# EAGLE schematic 016-5_spdif-simple_main_revb_sch-pcb (EAGLE 7.7.0)

## Sheet 1 of 5: SPDIF
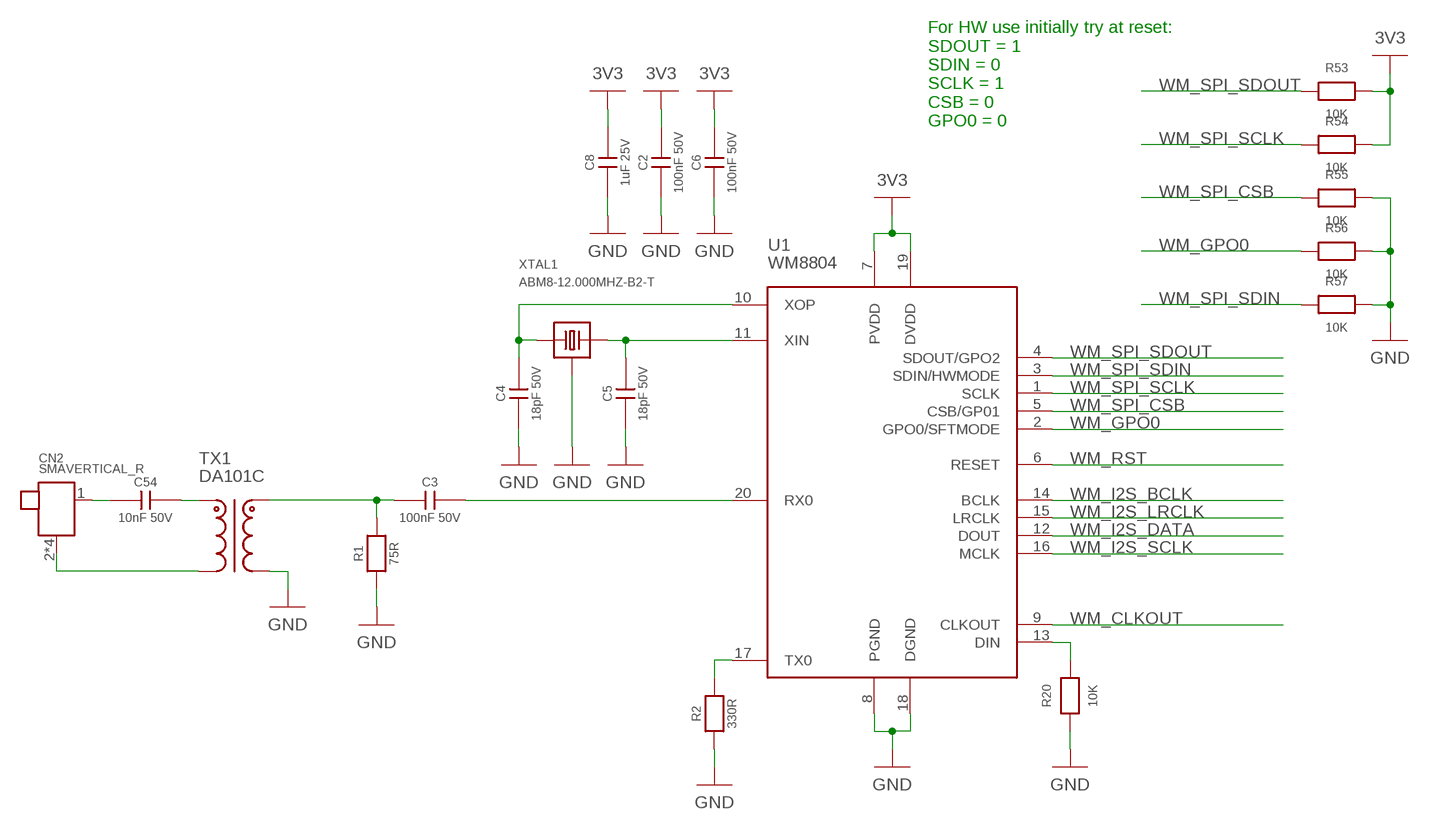
[diagram p0: schematic, sheet 1]

### Parts
C2  100nF 50V  VJ0603Y104KXACW1BC  [0603]
C3  100nF 50V  VJ0603Y104KXACW1BC  [0603]
C4  18pF 50V  MC0603N180J500CT  [0603]
C5  18pF 50V  MC0603N180J500CT  [0603]
C6  100nF 50V  VJ0603Y104KXACW1BC  [0603]
C8  1uF 25V  MC0603X105K250CT  [0603]
C54  10nF 50V  MC0603B103K500CT  [0603]
CN2  SMAVERTICAL_R  [SMAVERTICAL]
R1  75R  CRCW060375R0FKEA  [0603]
R2  330R  CRCW0603330RFKEA  [0603]
R20  10K  CRCW060310K0FKEA  [0603]
R53  10K  CRCW060310K0FKEA  [0603]
R54  10K  CRCW060310K0FKEA  [0603]
R55  10K  CRCW060310K0FKEA  [0603]
R56  10K  CRCW060310K0FKEA  [0603]
R57  10K  CRCW060310K0FKEA  [0603]
TX1  DA101C  [DA10XC]
U1  WM8804  WM8804GEDS/RV  [SSOP20-5MM]
XTAL1  ABM8-12.000MHZ-B2-T  [3.2X3.5SMD]

### Nets
3V3: C2.2 C6.2 C8.2 R53.2 R54.2 U1.7(PVDD) U1.19(DVDD) ; also sheet 2,4
GND: C2.1 C4.1 C5.1 C6.1 C8.1 R1.1 R2.1 R20.1 R55.2 R56.2 R57.2 TX1.4(B2) U1.8(PGND) U1.18(DGND) XTAL1.2(GND) XTAL1.4(GND) ; also sheet 2,3,4
N$4: C3.2 U1.20(RX0)
N$5: R2.2 U1.17(TX0)
N$11: C4.2 U1.10(XOP) XTAL1.3
N$12: C5.2 U1.11(XIN) XTAL1.1
N$13: R20.2 U1.13(DIN)
N$40: C54.2 TX1.1(A1)
N$46: CN2.2 CN2.3 CN2.4 CN2.5 TX1.3(A2)
N$55: C54.1 CN2.1
SPDIF_IN: C3.1 R1.2 TX1.6(B1)
WM_CLKOUT: U1.9(CLKOUT) ; also sheet 2
WM_GPO0: R56.1 U1.2(GPO0/SFTMODE) ; also sheet 2
WM_I2S_BCLK: U1.14(BCLK) ; also sheet 2
WM_I2S_DATA: U1.12(DOUT) ; also sheet 2
WM_I2S_LRCLK: U1.15(LRCLK) ; also sheet 2
WM_I2S_SCLK: U1.16(MCLK) ; also sheet 2
WM_RST: U1.6(RESET) ; also sheet 2
WM_SPI_CSB: R55.1 U1.5(CSB/GP01) ; also sheet 2
WM_SPI_SCLK: R54.1 U1.1(SCLK) ; also sheet 2
WM_SPI_SDIN: R57.1 U1.3(SDIN/HWMODE) ; also sheet 2
WM_SPI_SDOUT: R53.1 U1.4(SDOUT/GPO2) ; also sheet 2

### Notes on the sheet
- For HW use initially try at reset:
  SDOUT = 1
  SDIN = 0
  SCLK = 1
  CSB = 0
  GPO0 = 0

## Sheet 2 of 5: FPGA
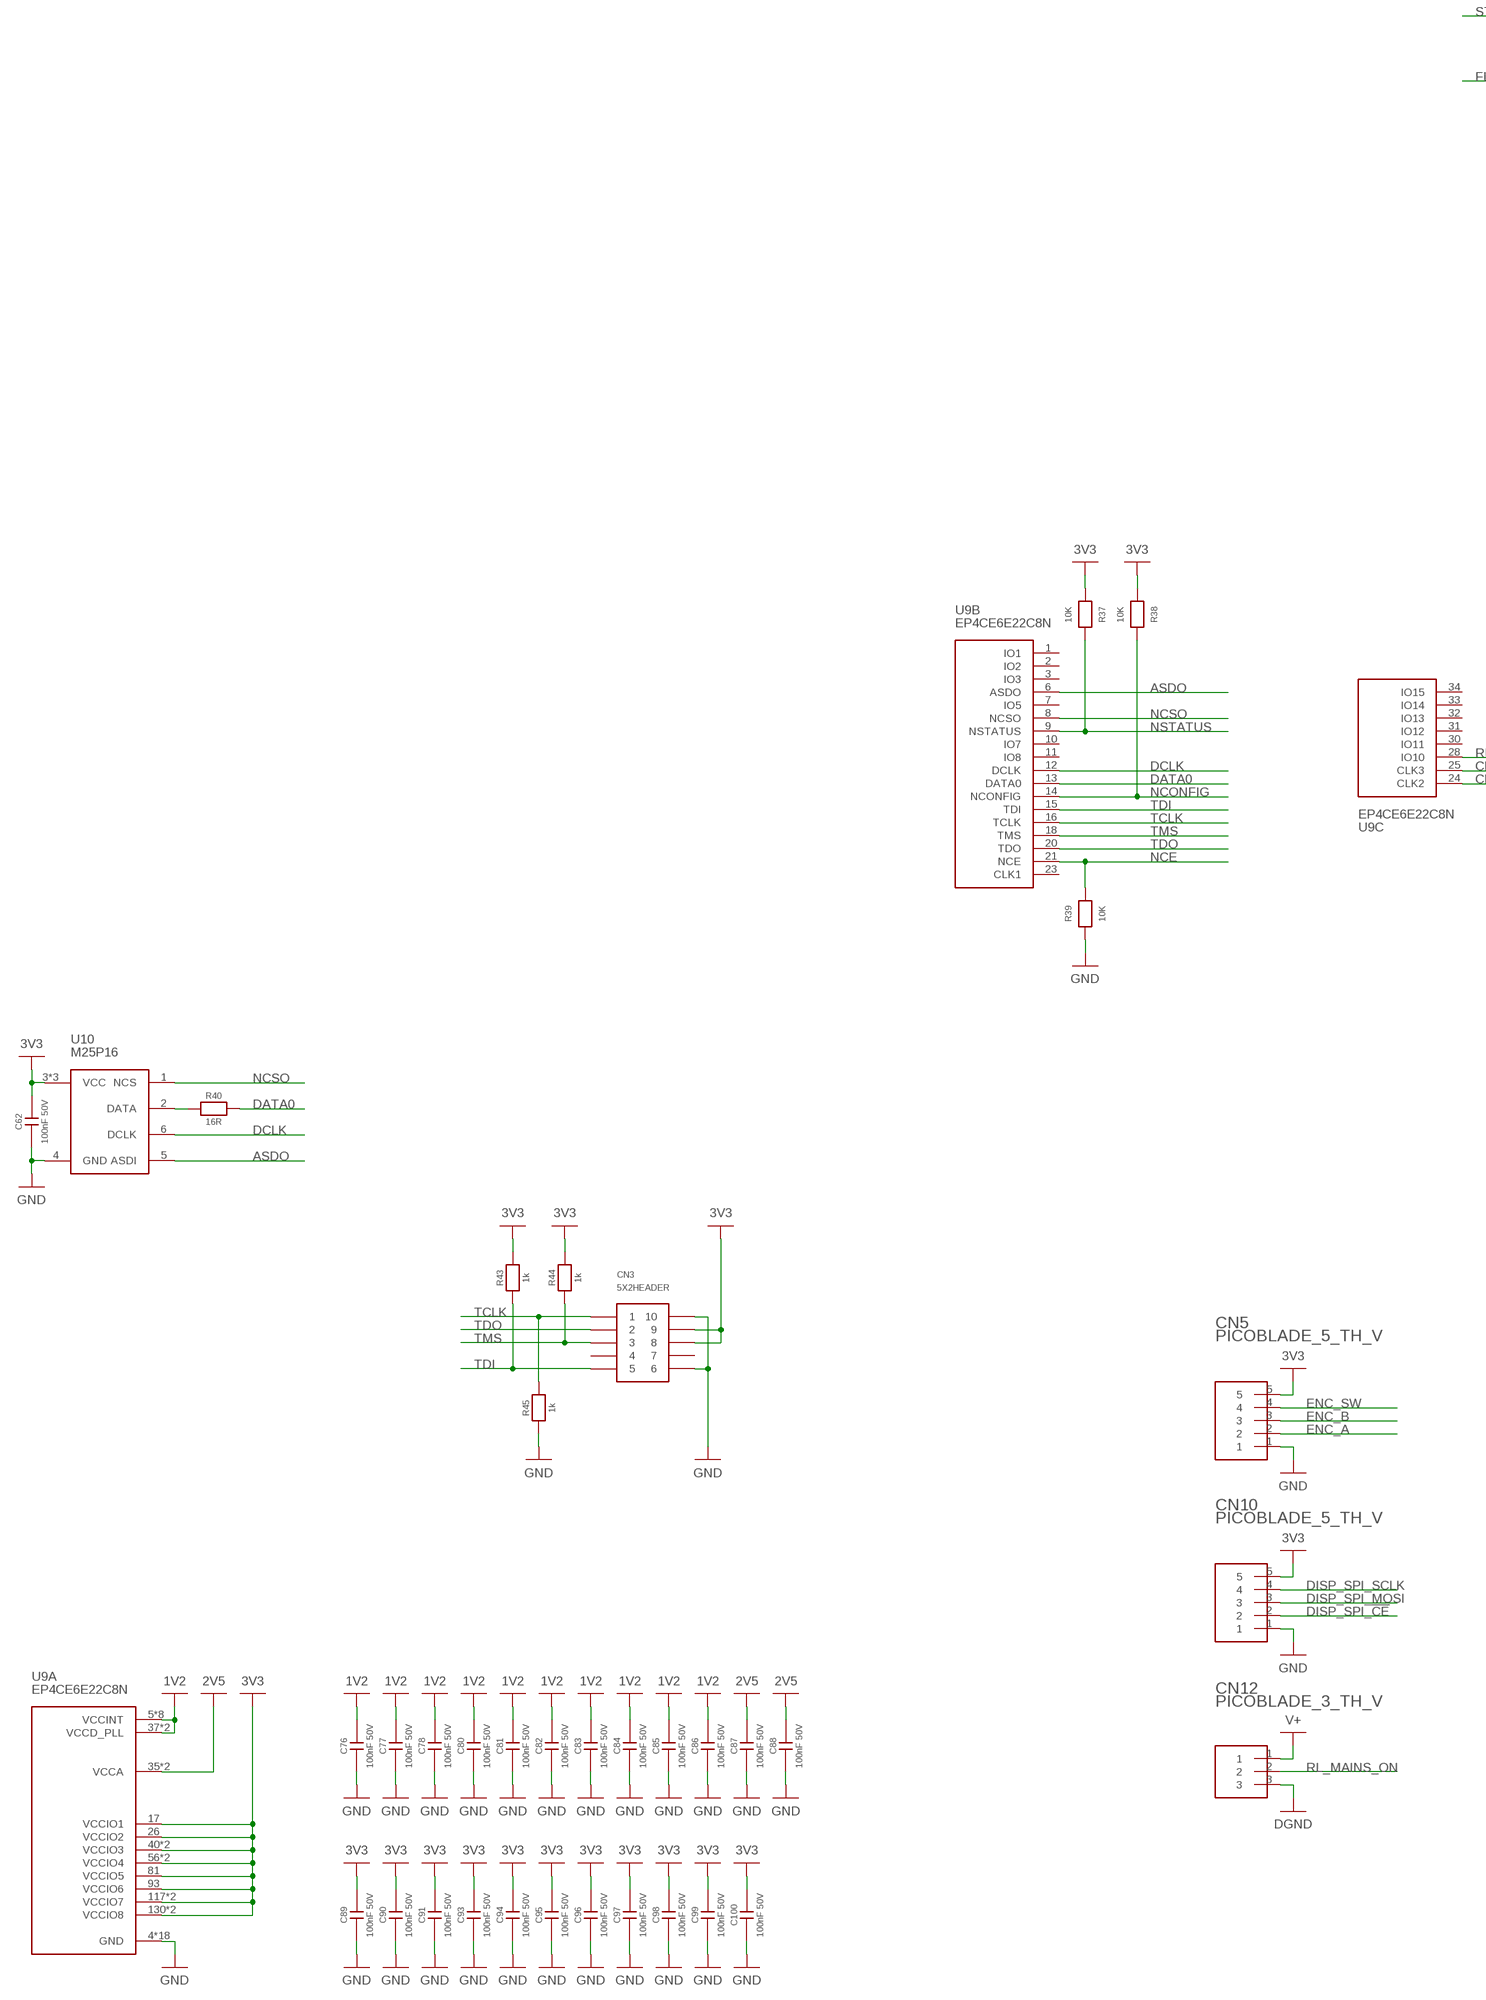
[diagram p1: schematic, sheet 2, part 1 of 2]
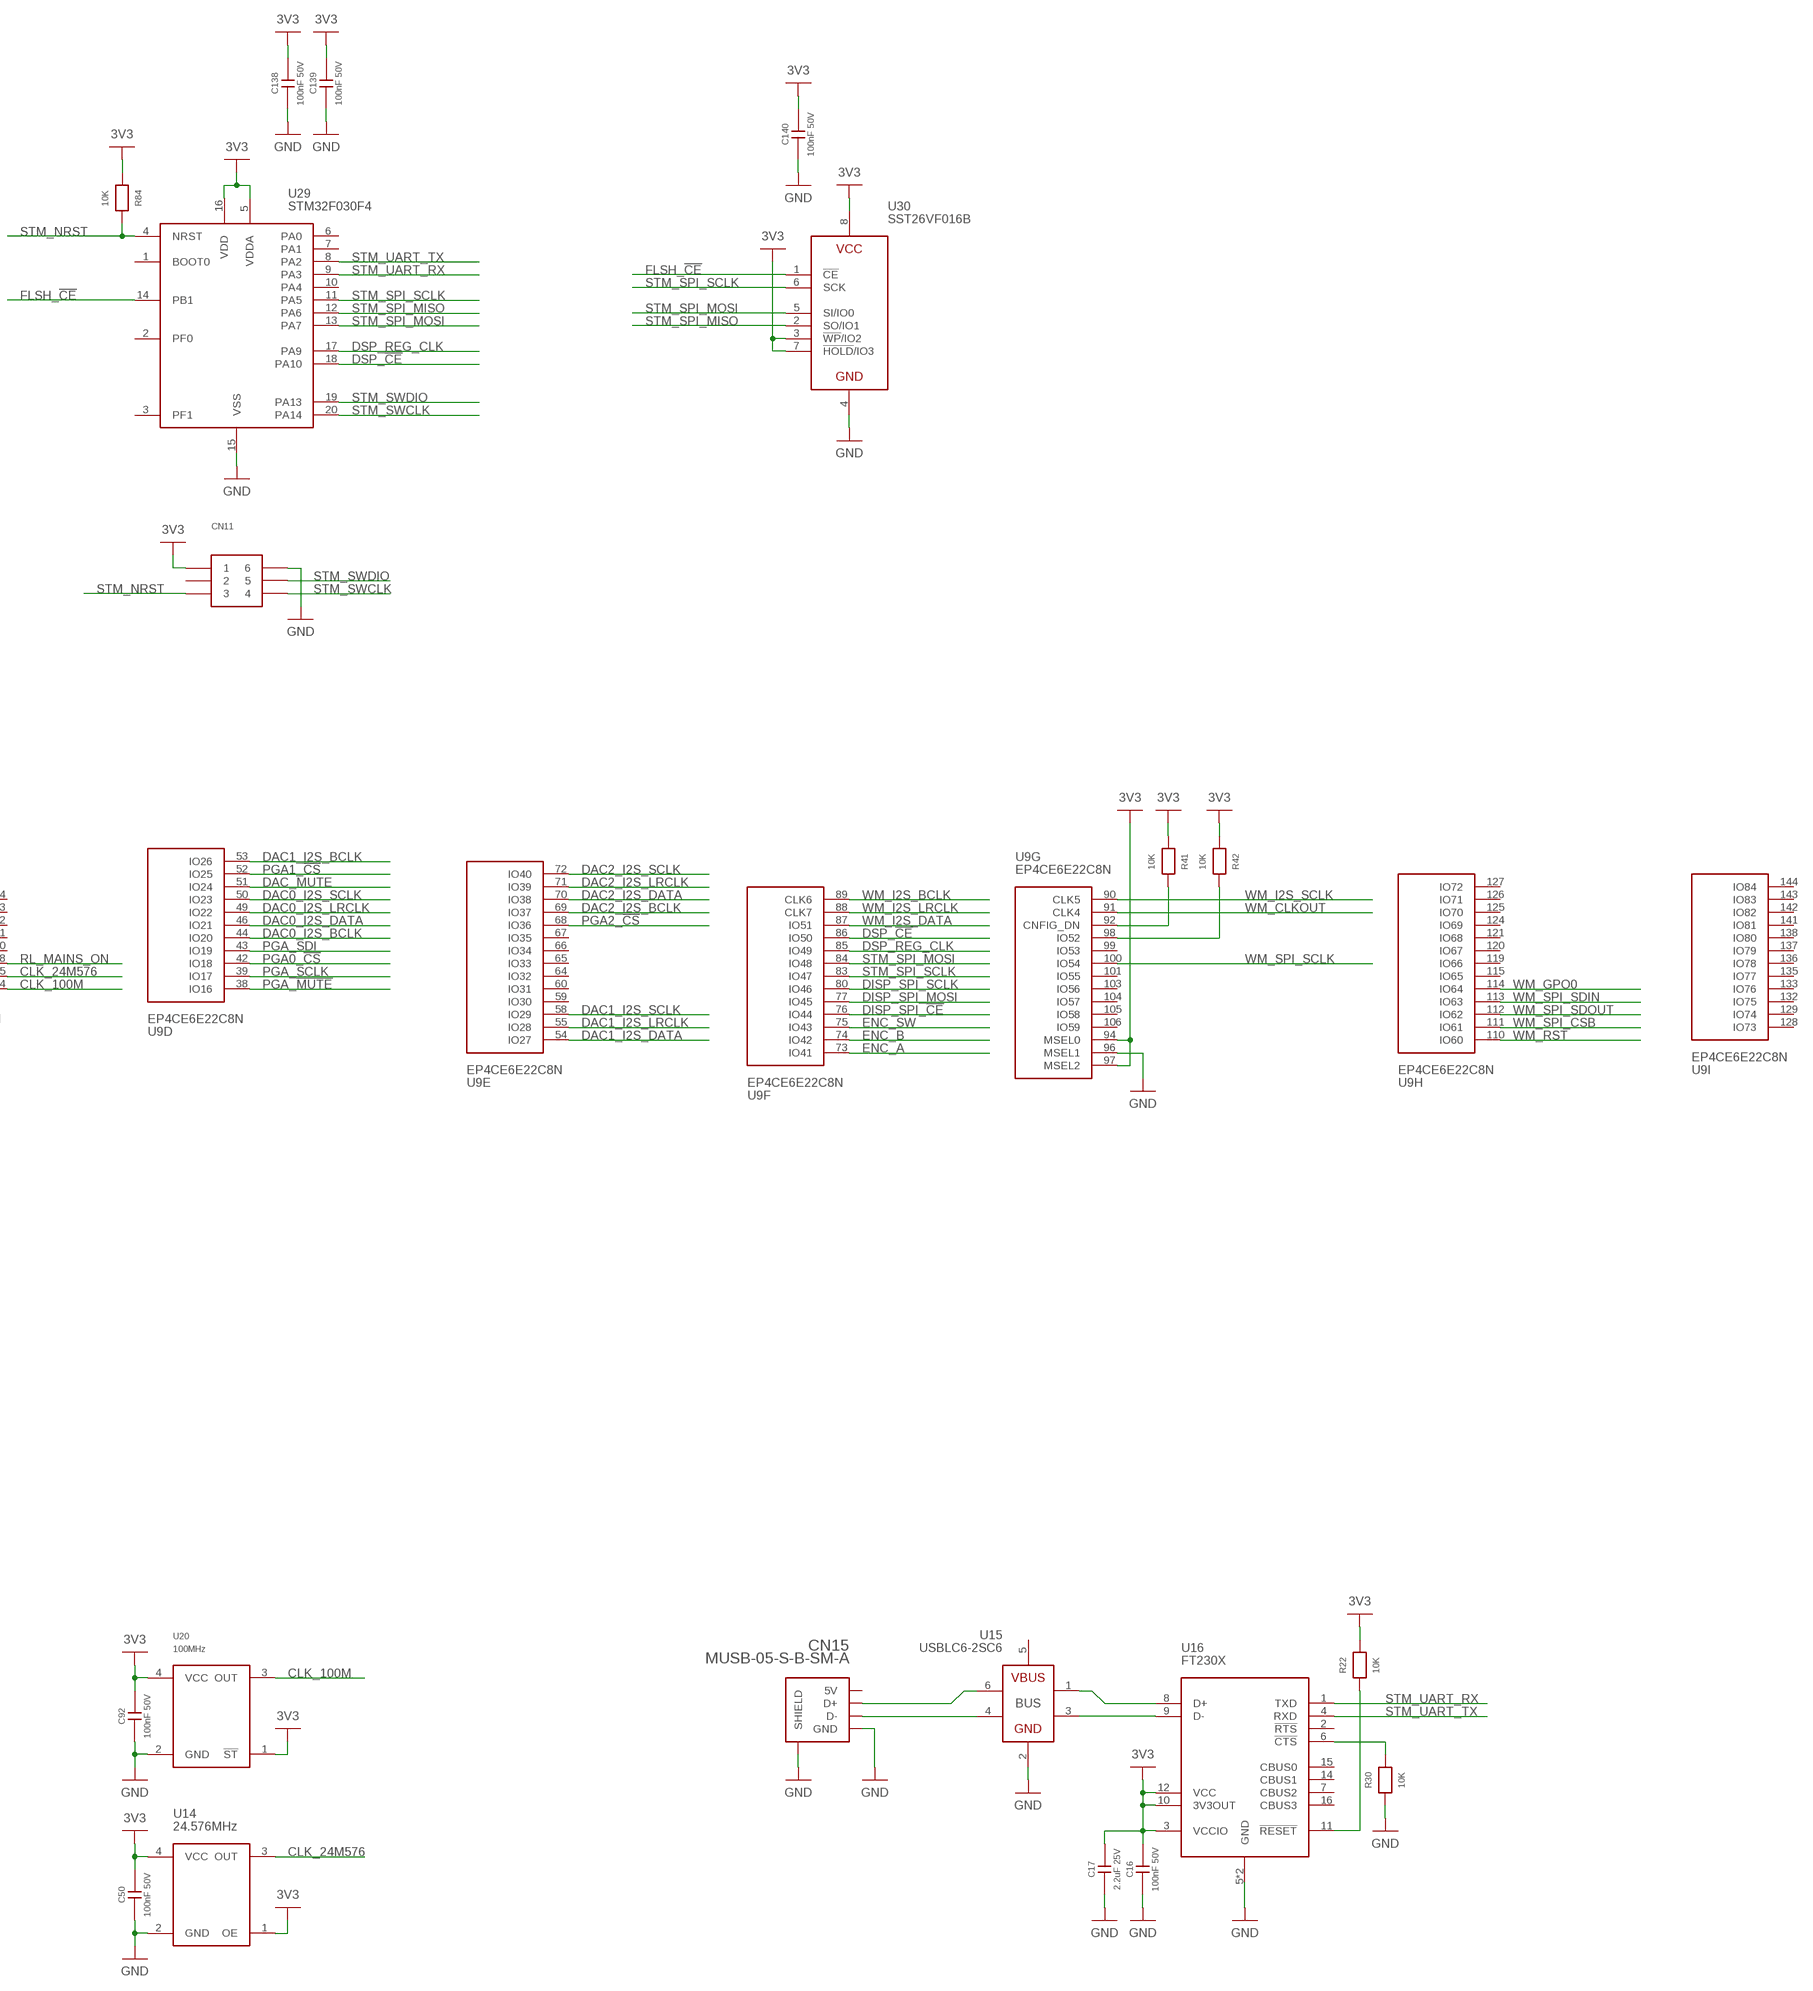
[diagram p2: schematic, sheet 2, part 2 of 2]

### Parts
C16  100nF 50V  VJ0603Y104KXACW1BC  [0603]
C17  2.2uF 25V  GRM188R61E225KA12D  [0603]
C50  100nF 50V  VJ0603Y104KXACW1BC  [0603]
C62  100nF 50V  VJ0603Y104KXACW1BC  [0603]
C76  100nF 50V  VJ0603Y104KXACW1BC  [0603]
C77  100nF 50V  VJ0603Y104KXACW1BC  [0603]
C78  100nF 50V  VJ0603Y104KXACW1BC  [0603]
C80  100nF 50V  VJ0603Y104KXACW1BC  [0603]
C81  100nF 50V  VJ0603Y104KXACW1BC  [0603]
C82  100nF 50V  VJ0603Y104KXACW1BC  [0603]
C83  100nF 50V  VJ0603Y104KXACW1BC  [0603]
C84  100nF 50V  VJ0603Y104KXACW1BC  [0603]
C85  100nF 50V  VJ0603Y104KXACW1BC  [0603]
C86  100nF 50V  VJ0603Y104KXACW1BC  [0603]
C87  100nF 50V  VJ0603Y104KXACW1BC  [0603]
C88  100nF 50V  VJ0603Y104KXACW1BC  [0603]
C89  100nF 50V  VJ0603Y104KXACW1BC  [0603]
C90  100nF 50V  VJ0603Y104KXACW1BC  [0603]
C91  100nF 50V  VJ0603Y104KXACW1BC  [0603]
C92  100nF 50V  VJ0603Y104KXACW1BC  [0603]
C93  100nF 50V  VJ0603Y104KXACW1BC  [0603]
C94  100nF 50V  VJ0603Y104KXACW1BC  [0603]
C95  100nF 50V  VJ0603Y104KXACW1BC  [0603]
C96  100nF 50V  VJ0603Y104KXACW1BC  [0603]
C97  100nF 50V  VJ0603Y104KXACW1BC  [0603]
C98  100nF 50V  VJ0603Y104KXACW1BC  [0603]
C99  100nF 50V  VJ0603Y104KXACW1BC  [0603]
C100  100nF 50V  VJ0603Y104KXACW1BC  [0603]
C138  100nF 50V  VJ0603Y104KXACW1BC  [0603]
C139  100nF 50V  VJ0603Y104KXACW1BC  [0603]
C140  100nF 50V  VJ0603Y104KXACW1BC  [0603]
CN3  5X2HEADER  [5X2_2.54MMHEADER]
CN5  PICOBLADE_5_TH_V  [MOLEX_530470510]
CN10  PICOBLADE_5_TH_V  [MOLEX_530470510]
CN11  2X3_HEADER  [2X3HEADER]
CN12  PICOBLADE_3_TH_V  [MOLEX_530470310]
CN15  MUSB-05-S-B-SM-A  [MUSB-05-S-B-SM-A]
R22  10K  CRCW060310K0FKEA  [0603]
R30  10K  CRCW060310K0FKEA  [0603]
R37  10K  CRCW060310K0FKEA  [0603]
R38  10K  CRCW060310K0FKEA  [0603]
R39  10K  CRCW060310K0FKEA  [0603]
R40  16R  CRCW060316R0FKEA  [0603]
R41  10K  CRCW060310K0FKEA  [0603]
R42  10K  CRCW060310K0FKEA  [0603]
R43  1k  CRCW06031K00FKEA  [0603]
R44  1k  CRCW06031K00FKEA  [0603]
R45  1k  CRCW06031K00FKEA  [0603]
R84  10K  CRCW060310K0FKEA  [0603]
U9  EP4CE6E22C8N  [QFP144_PP]
U10  M25P16  M25P16-VMN6P  [SO8]
U14  24.576MHz  ASEMB-24.576MHZ  [ASEMB]
U15  USBLC6-2SC6  [SOT23-6]
U16  FT230X  FT230XS  [SSOP16-4MM]
U20  100MHz  510BBA100M000BAG  [5X3.2SEAM]
U29  STM32F030F4  [SSOP20-4.5MM]
U30  SST26VF016B  SST26VF016B-104I/SN  [SO8]

### Nets
1V2: C76.2 C77.2 C78.2 C80.2 C81.2 C82.2 C83.2 C84.2 C85.2 C86.2 U9.5(A:VCCINT) U9.29(A:VCCINT) U9.37(A:VCCD_PLL) U9.45(A:VCCINT) U9.61(A:VCCINT) U9.78(A:VCCINT) U9.102(A:VCCINT) U9.109(A:VCCD_PLL) U9.116(A:VCCINT) U9.134(A:VCCINT) ; also sheet 4
2V5: C87.2 C88.2 U9.35(A:VCCA) U9.107(A:VCCA) ; also sheet 4
3V3: C16.2 C17.2 C50.2 C62.2 C89.2 C90.2 C91.2 C92.2 C93.2 C94.2 C95.2 C96.2 C97.2 C98.2 C99.2 C100.2 C138.2 C139.2 C140.2 CN3.8 CN3.9 CN5.5 CN10.5 CN11.1 R22.2 R37.1 R38.1 R41.1 R42.1 R43.2 R44.2 R84.1 U9.17(A:VCCIO1) U9.26(A:VCCIO2) U9.40(A:VCCIO3) U9.47(A:VCCIO3) U9.56(A:VCCIO4) U9.62(A:VCCIO4) U9.81(A:VCCIO5) U9.93(A:VCCIO6) U9.94(G:MSEL0) U9.97(G:MSEL2) U9.117(A:VCCIO7) U9.122(A:VCCIO7) U9.130(A:VCCIO8) U9.139(A:VCCIO8) U10.3(VCC) U10.7(VCC) U10.8(VCC) U14.1(OE) U14.4(VCC) U16.3(VCCIO) U16.10(3V3OUT) U16.12(VCC) U20.1(!ST) U20.4(VCC) U29.5(VDDA) U29.16(VDD) U30.3(!WP!/IO2) U30.7(!HOLD!/IO3) U30.8(VCC) ; also sheet 1,4
ASDO: U9.6(B:ASDO) U10.5(ASDI)
CLK_24M576: U9.25(C:CLK3) U14.3(OUT)
CLK_100M: U9.24(C:CLK2) U20.3(OUT)
CONF_DN: R41.2 U9.92(G:CNFIG_DN)
DAC0_I2S_BCLK: U9.44(D:IO20) ; also sheet 3
DAC0_I2S_DATA: U9.46(D:IO21) ; also sheet 3
DAC0_I2S_LRCLK: U9.49(D:IO22) ; also sheet 3
DAC0_I2S_SCLK: U9.50(D:IO23) ; also sheet 3
DAC1_I2S_BCLK: U9.53(D:IO26) ; also sheet 3
DAC1_I2S_DATA: U9.54(E:IO27) ; also sheet 3
DAC1_I2S_LRCLK: U9.55(E:IO28) ; also sheet 3
DAC1_I2S_SCLK: U9.58(E:IO29) ; also sheet 3
DAC2_I2S_BCLK: U9.69(E:IO37) ; also sheet 3
DAC2_I2S_DATA: U9.70(E:IO38) ; also sheet 3
DAC2_I2S_LRCLK: U9.71(E:IO39) ; also sheet 3
DAC2_I2S_SCLK: U9.72(E:IO40) ; also sheet 3
DAC_MUTE: U9.51(D:IO24) ; also sheet 3
DATA0: R40.2 U9.13(B:DATA0)
DCLK: U9.12(B:DCLK) U10.6(DCLK)
DGND: CN12.3
DISP_SPI_!CE: CN10.2 U9.76(F:IO44)
DISP_SPI_MOSI: CN10.3 U9.77(F:IO45)
DISP_SPI_SCLK: CN10.4 U9.80(F:IO46)
DSP_!CE: U9.86(F:IO50) U29.18(PA10)
DSP_REG_CLK: U9.85(F:IO49) U29.17(PA9)
ENC_A: CN5.2 U9.73(F:IO41)
ENC_B: CN5.3 U9.74(F:IO42)
ENC_SW: CN5.4 U9.75(F:IO43)
FLSH_!CE: U29.14(PB1) U30.1(!CE)
GND: C16.1 C17.1 C50.1 C62.1 C76.1 C77.1 C78.1 C80.1 C81.1 C82.1 C83.1 C84.1 C85.1 C86.1 C87.1 C88.1 C89.1 C90.1 C91.1 C92.1 C93.1 C94.1 C95.1 C96.1 C97.1 C98.1 C99.1 C100.1 C138.1 C139.1 C140.1 CN3.6 CN3.10 CN5.1 CN10.1 CN11.6 CN15.GND CN15.SHIELD1(SHIELD) CN15.SHIELD2(SHIELD) CN15.SHIELD3(SHIELD) CN15.SHIELD4(SHIELD) R30.1 R39.1 R45.1 U9.4(A:GND) U9.19(A:GND) U9.22(A:GND) U9.27(A:GND) U9.36(A:GND) U9.41(A:GND) U9.48(A:GND) U9.57(A:GND) U9.63(A:GND) U9.79(A:GND) U9.82(A:GND) U9.95(A:GND) U9.96(G:MSEL1) U9.108(A:GND) U9.118(A:GND) U9.123(A:GND) U9.131(A:GND) U9.140(A:GND) U9.GND(A:GND) U10.4(GND) U14.2(GND) U15.2(GND) U16.5(GND) U16.13(GND) U20.2(GND) U29.15(VSS) U30.4(GND) ; also sheet 1,3,4
INIT_DONE: R42.2 U9.98(G:IO52)
N$17: R40.1 U10.2(DATA)
N$27: CN15.D- U15.4(D-OUT)
N$28: CN15.D+ U15.6(D+_OUT)
N$29: U15.3(D-_IN) U16.9(D-)
N$53: U15.1(D+_IN) U16.8(D+)
N$54: R22.1 U16.11(!RESET)
N$56: R30.2 U16.6(!CTS)
NCE: R39.2 U9.21(B:NCE)
NCONFIG: R38.2 U9.14(B:NCONFIG)
NCSO: U9.8(B:NCSO) U10.1(NCS)
NSTATUS: R37.2 U9.9(B:NSTATUS)
PGA0_!CS: U9.42(D:IO18) ; also sheet 3
PGA1_!CS: U9.52(D:IO25) ; also sheet 3
PGA2_!CS: U9.68(E:IO36) ; also sheet 3
PGA_!MUTE: U9.38(D:IO16) ; also sheet 3
PGA_SCLK: U9.39(D:IO17) ; also sheet 3
PGA_SDI: U9.43(D:IO19) ; also sheet 3
RL_MAINS_ON: CN12.2 U9.28(C:IO10)
STM_NRST: CN11.3 R84.2 U29.4(NRST)
STM_SPI_MISO: U29.12(PA6) U30.2(SO/IO1)
STM_SPI_MOSI: U9.84(F:IO48) U29.13(PA7) U30.5(SI/IO0)
STM_SPI_SCLK: U9.83(F:IO47) U29.11(PA5) U30.6(SCK)
STM_SWCLK: CN11.4 U29.20(PA14)
STM_SWDIO: CN11.5 U29.19(PA13)
STM_UART_RX: U16.1(TXD) U29.9(PA3)
STM_UART_TX: U16.4(RXD) U29.8(PA2)
TCLK: CN3.1 R45.2 U9.16(B:TCLK)
TDI: CN3.5 R43.1 U9.15(B:TDI)
TDO: CN3.2 U9.20(B:TDO)
TMS: CN3.3 R44.1 U9.18(B:TMS)
V+: CN12.1 ; also sheet 4
WM_CLKOUT: U9.91(G:CLK4) ; also sheet 1
WM_GPO0: U9.114(H:IO64) ; also sheet 1
WM_I2S_BCLK: U9.89(F:CLK6) ; also sheet 1
WM_I2S_DATA: U9.87(F:IO51) ; also sheet 1
WM_I2S_LRCLK: U9.88(F:CLK7) ; also sheet 1
WM_I2S_SCLK: U9.90(G:CLK5) ; also sheet 1
WM_RST: U9.110(H:IO60) ; also sheet 1
WM_SPI_CSB: U9.111(H:IO61) ; also sheet 1
WM_SPI_SCLK: U9.100(G:IO54) ; also sheet 1
WM_SPI_SDIN: U9.113(H:IO63) ; also sheet 1
WM_SPI_SDOUT: U9.112(H:IO62) ; also sheet 1
Unconnected: CN3.4 CN3.7 CN11.2 CN15.VCC(5V) U9.1(B:IO1) U9.2(B:IO2) U9.3(B:IO3) U9.7(B:IO5) U9.10(B:IO7) U9.11(B:IO8) U9.23(B:CLK1) U9.30(C:IO11) U9.31(C:IO12) U9.32(C:IO13) U9.33(C:IO14) U9.34(C:IO15) U9.59(E:IO30) U9.60(E:IO31) U9.64(E:IO32) U9.65(E:IO33) U9.66(E:IO34) U9.67(E:IO35) U9.99(G:IO53) U9.101(G:IO55) U9.103(G:IO56) U9.104(G:IO57) U9.105(G:IO58) U9.106(G:IO59) U9.115(H:IO65) U9.119(H:IO66) U9.120(H:IO67) U9.121(H:IO68) U9.124(H:IO69) U9.125(H:IO70) U9.126(H:IO71) U9.127(H:IO72) U9.128(I:IO73) U9.129(I:IO74) U9.132(I:IO75) U9.133(I:IO76) U9.135(I:IO77) U9.136(I:IO78) U9.137(I:IO79) U9.138(I:IO80) U9.141(I:IO81) U9.142(I:IO82) U9.143(I:IO83) U9.144(I:IO84) U15.5(VBUS) U16.2(!RTS) U16.7(CBUS2) U16.14(CBUS1) U16.15(CBUS0) U16.16(CBUS3) U29.1(BOOT0) U29.2(PF0) U29.3(PF1) U29.6(PA0) U29.7(PA1) U29.10(PA4)

## Sheet 3 of 5: DAC
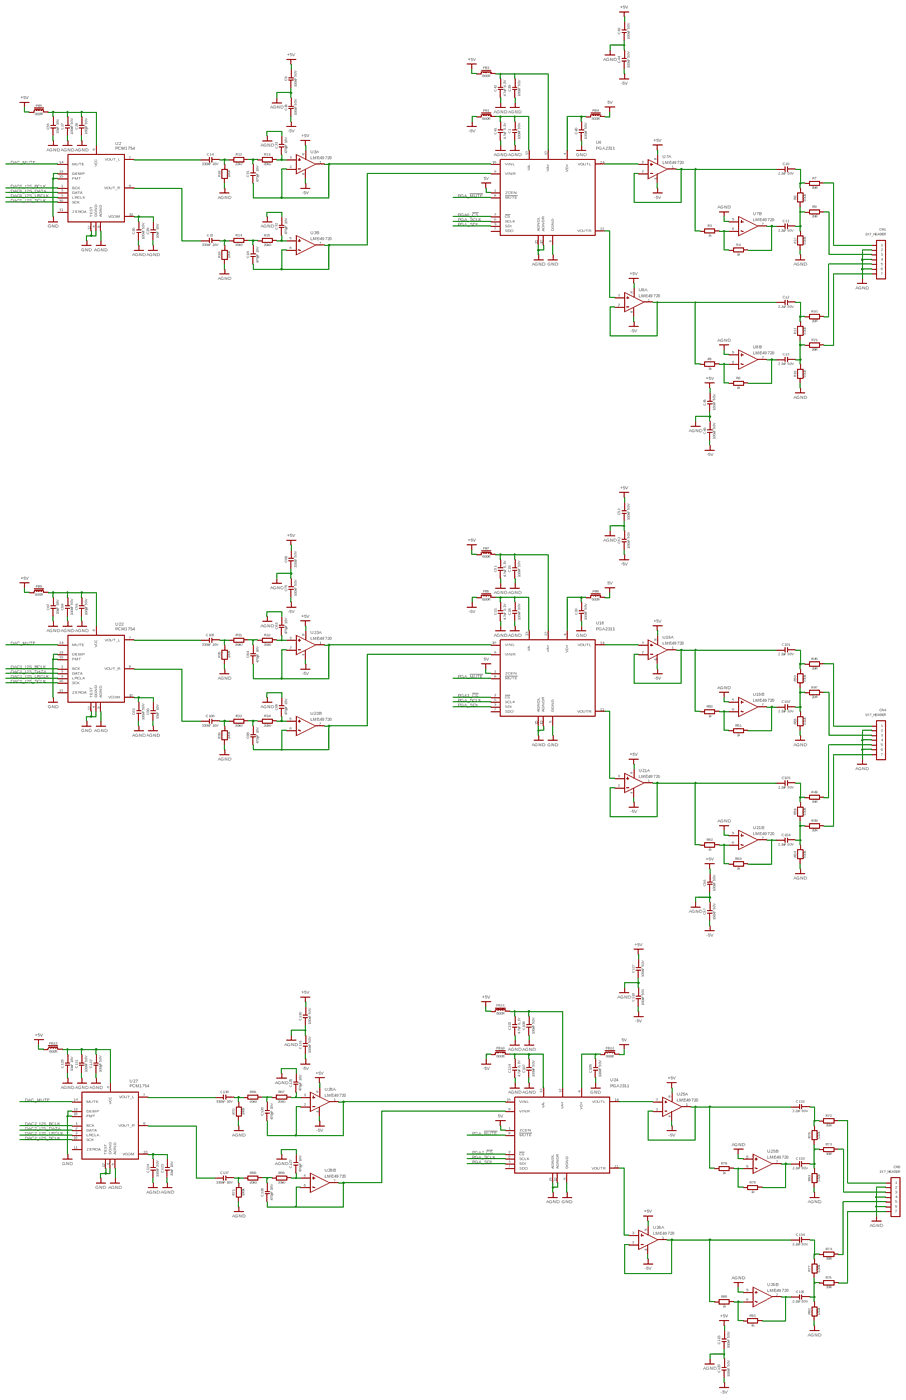
[diagram p3: schematic, sheet 3, overview]
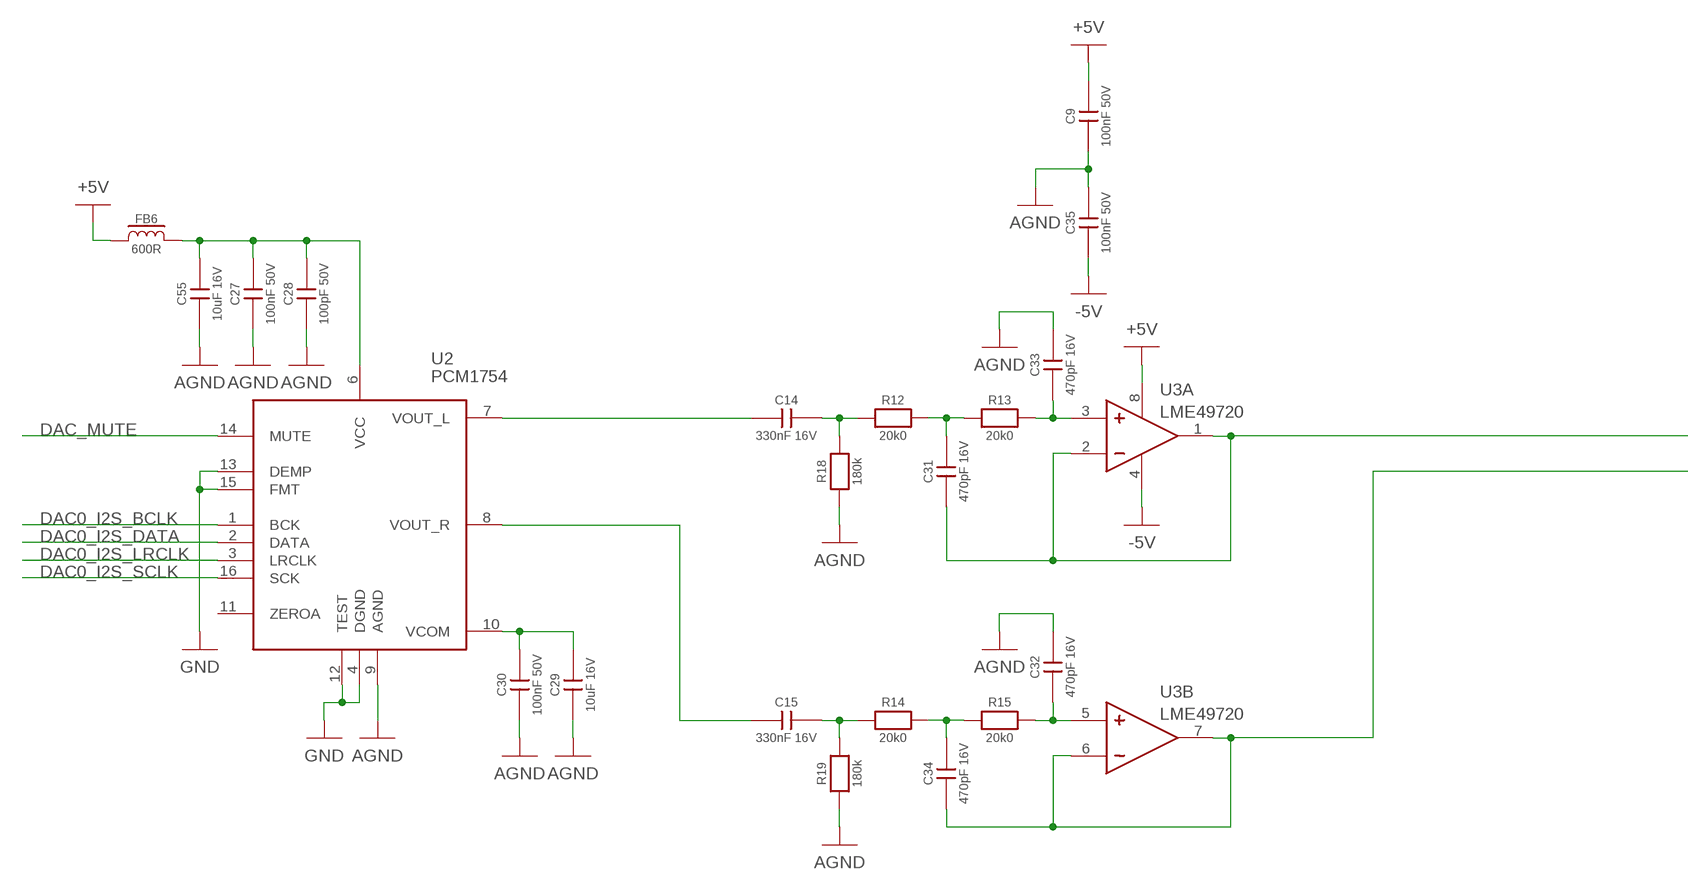
[diagram p4: schematic, sheet 3, part 1 of 4]
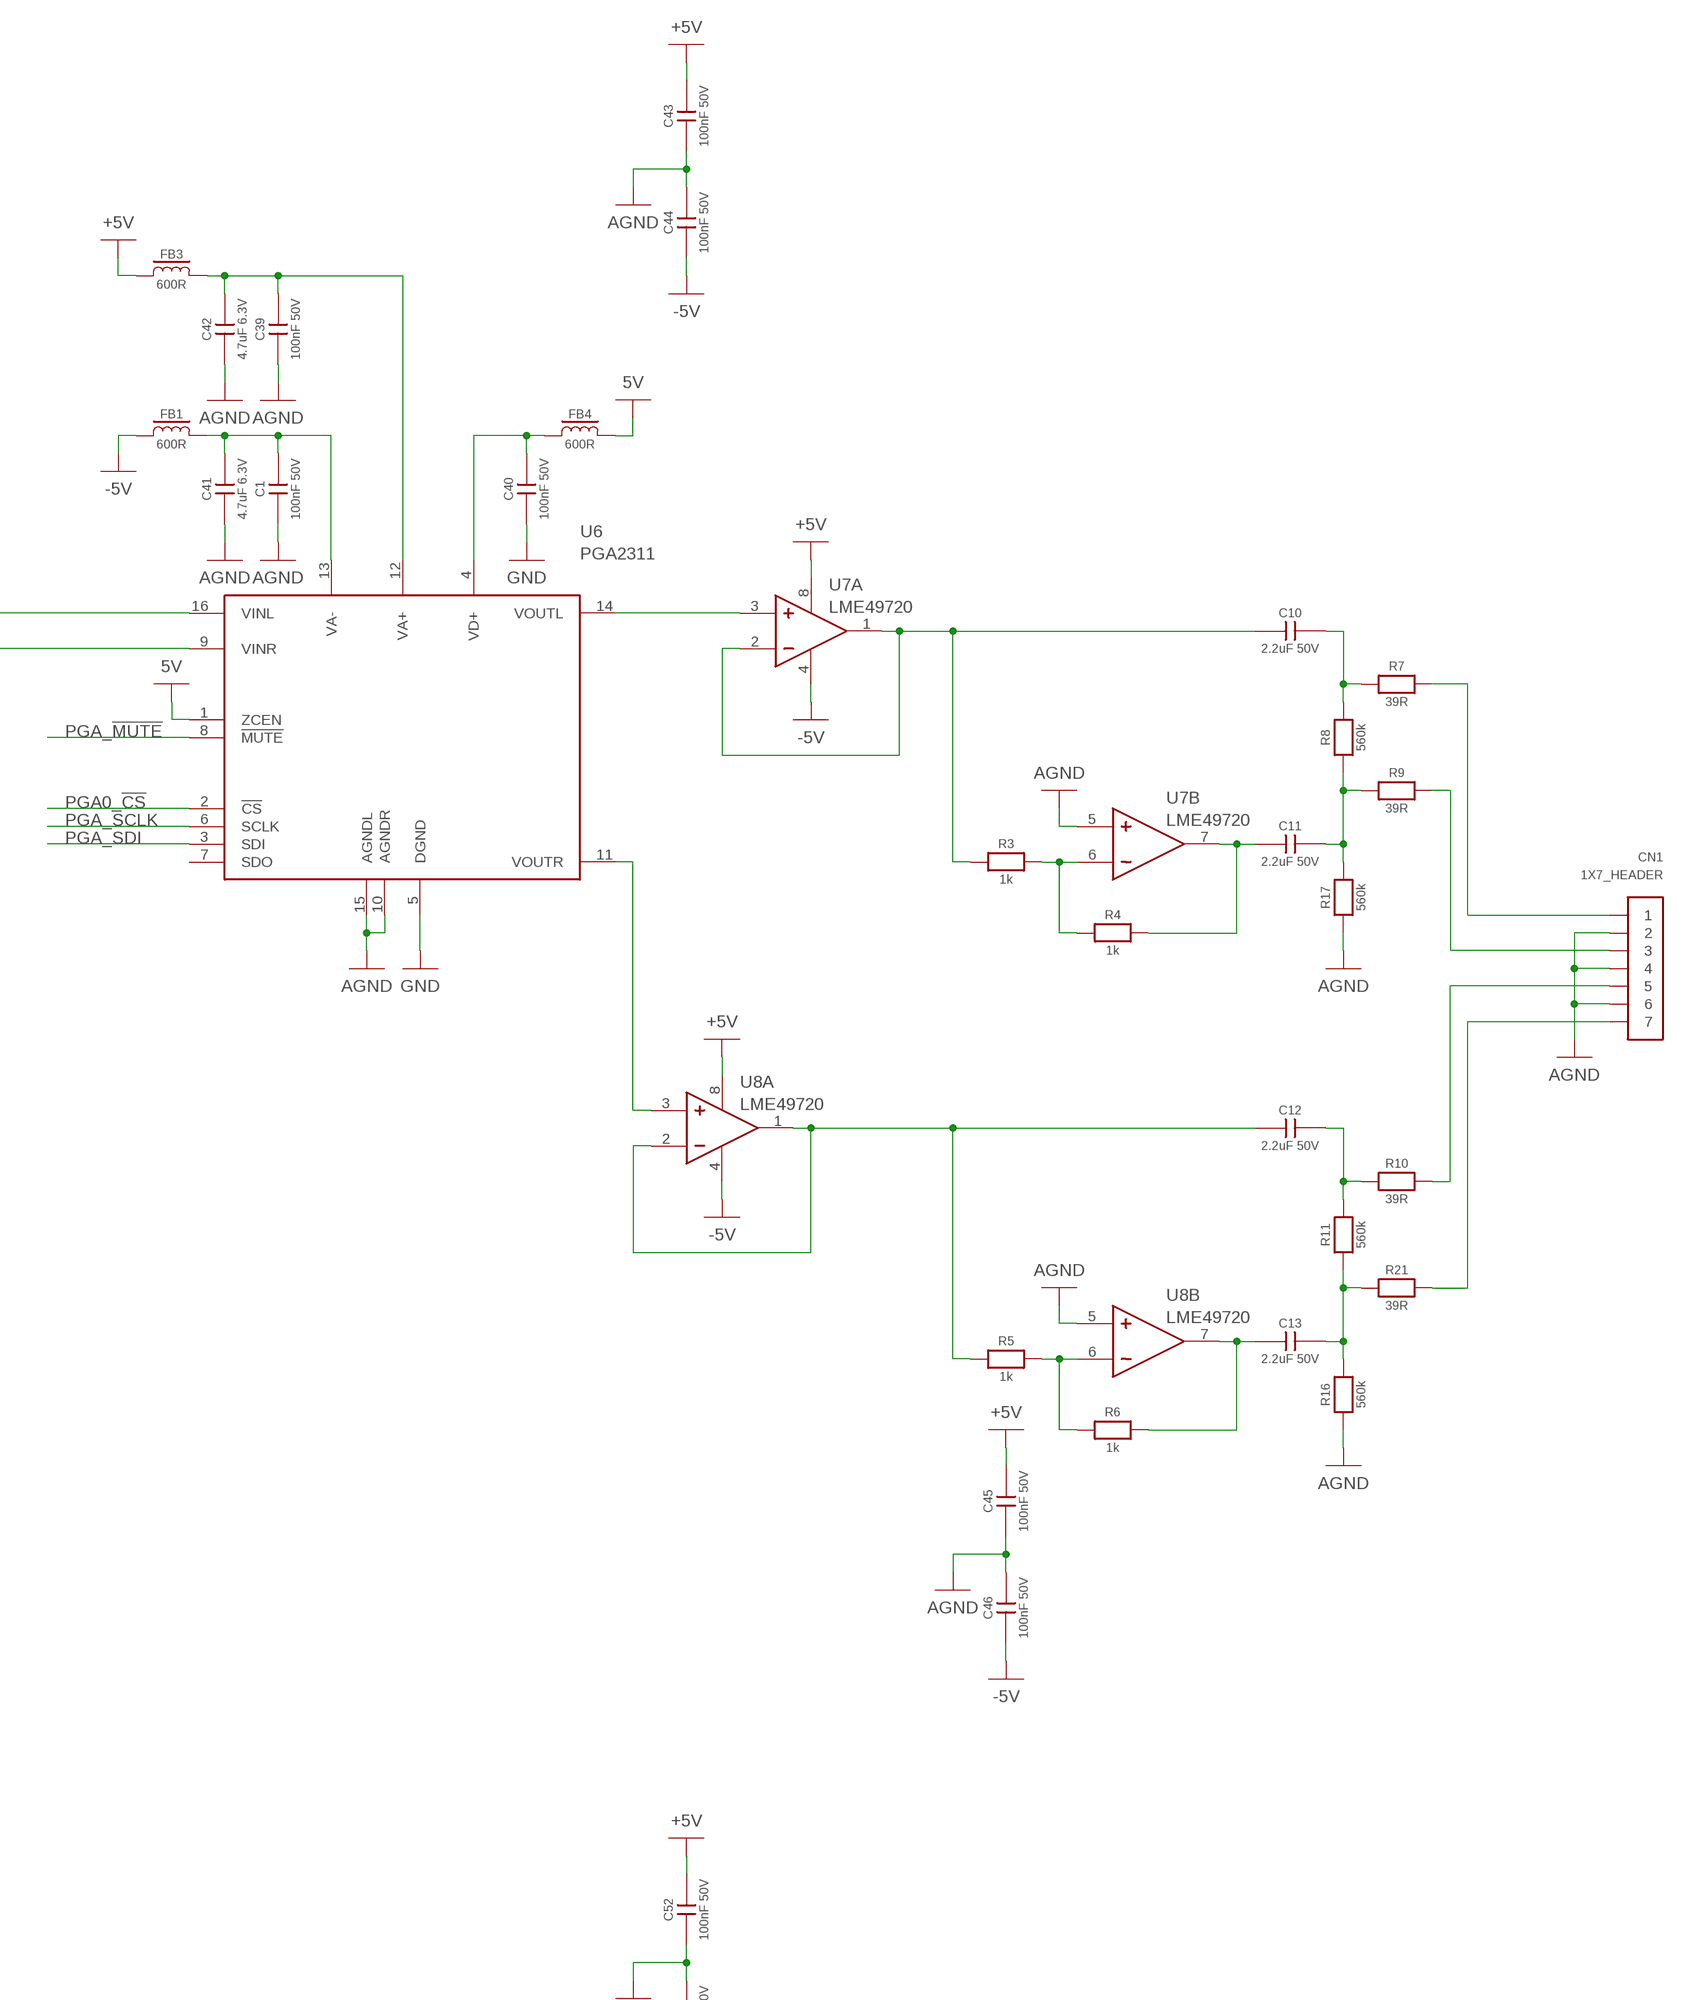
[diagram p5: schematic, sheet 3, part 2 of 4]
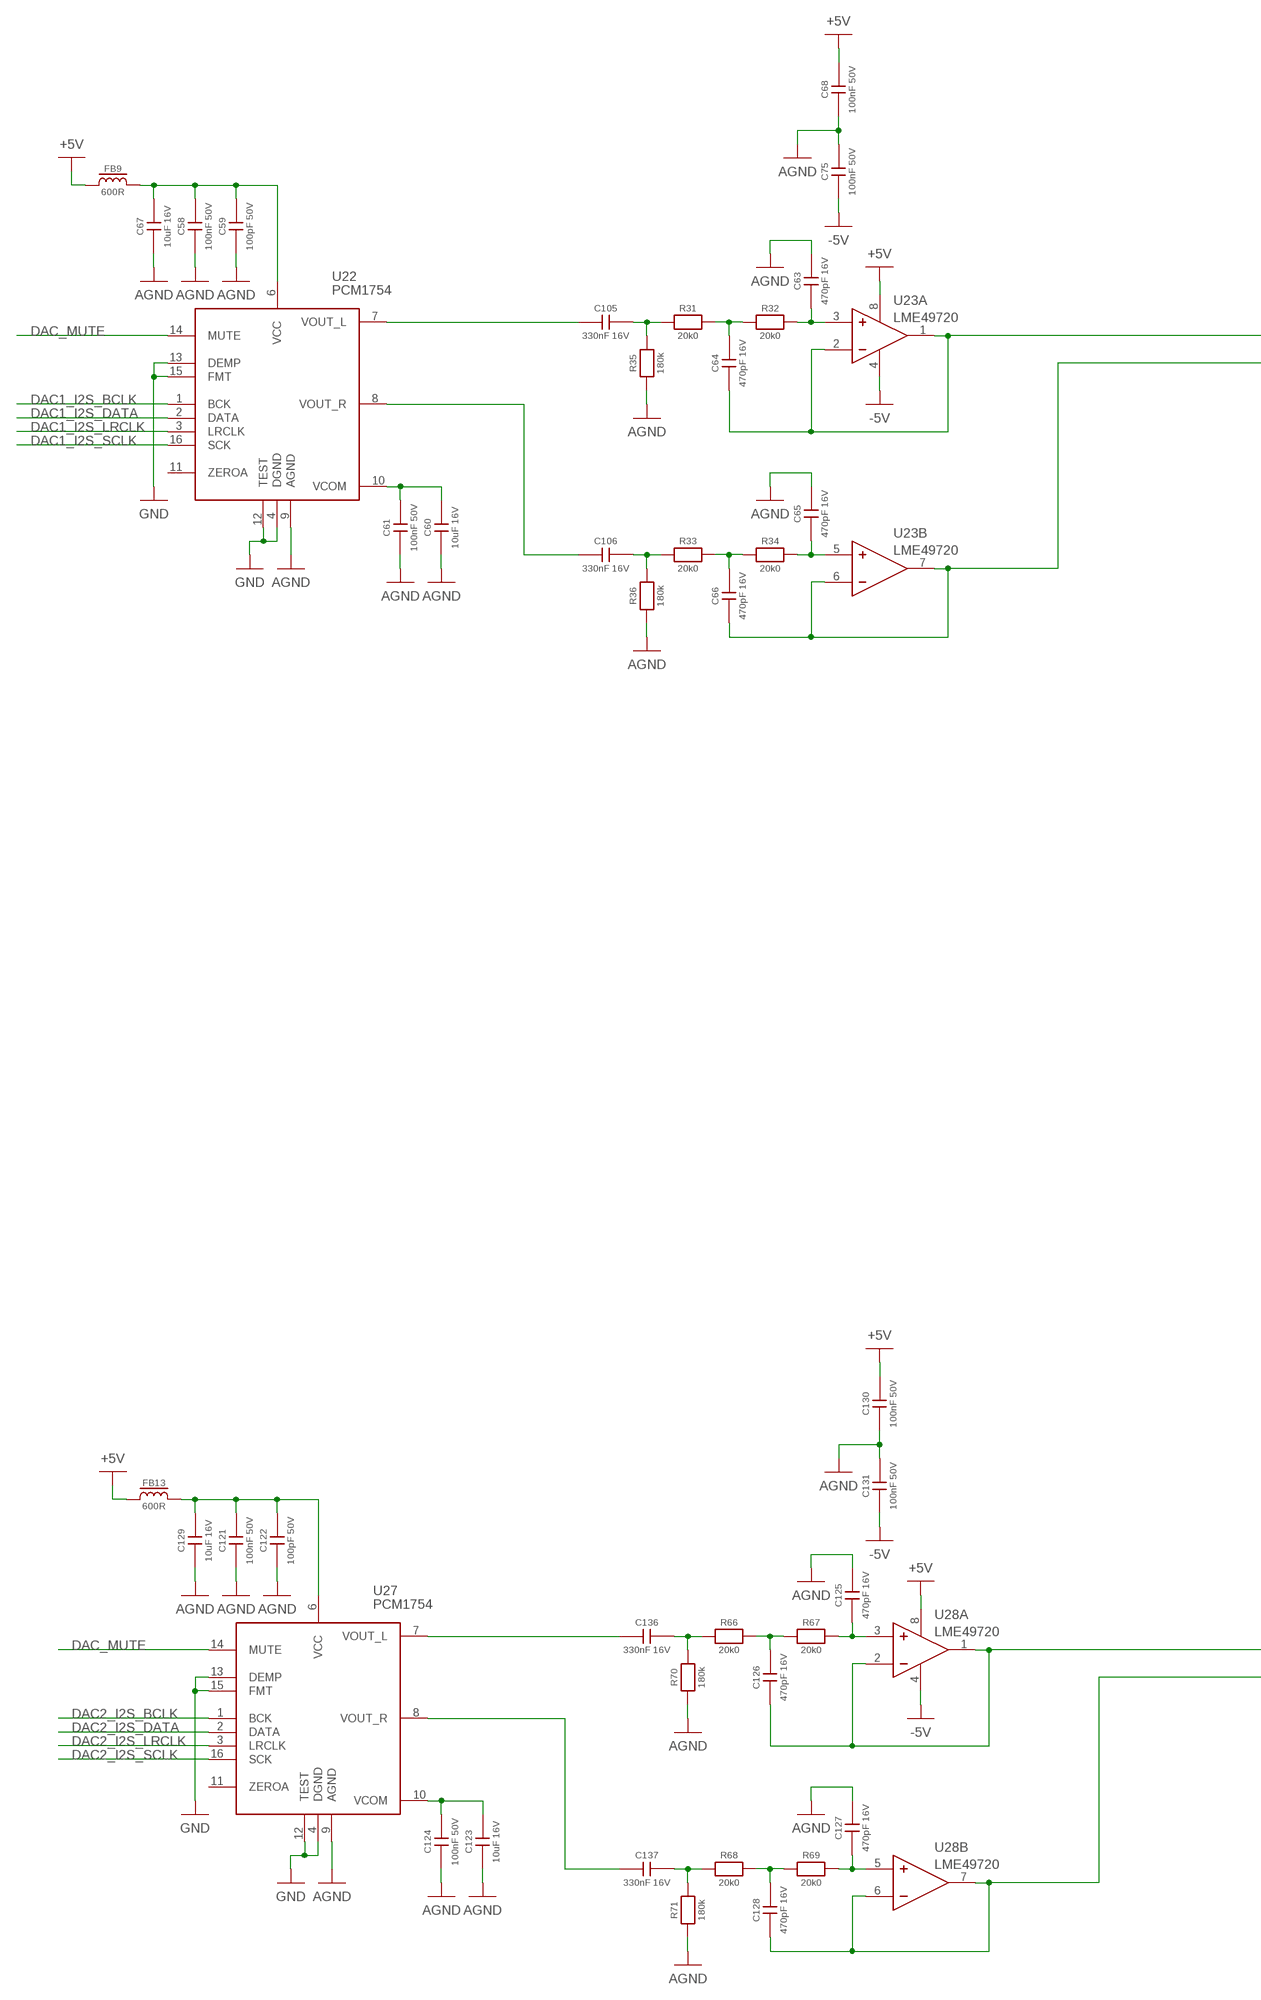
[diagram p6: schematic, sheet 3, part 3 of 4]
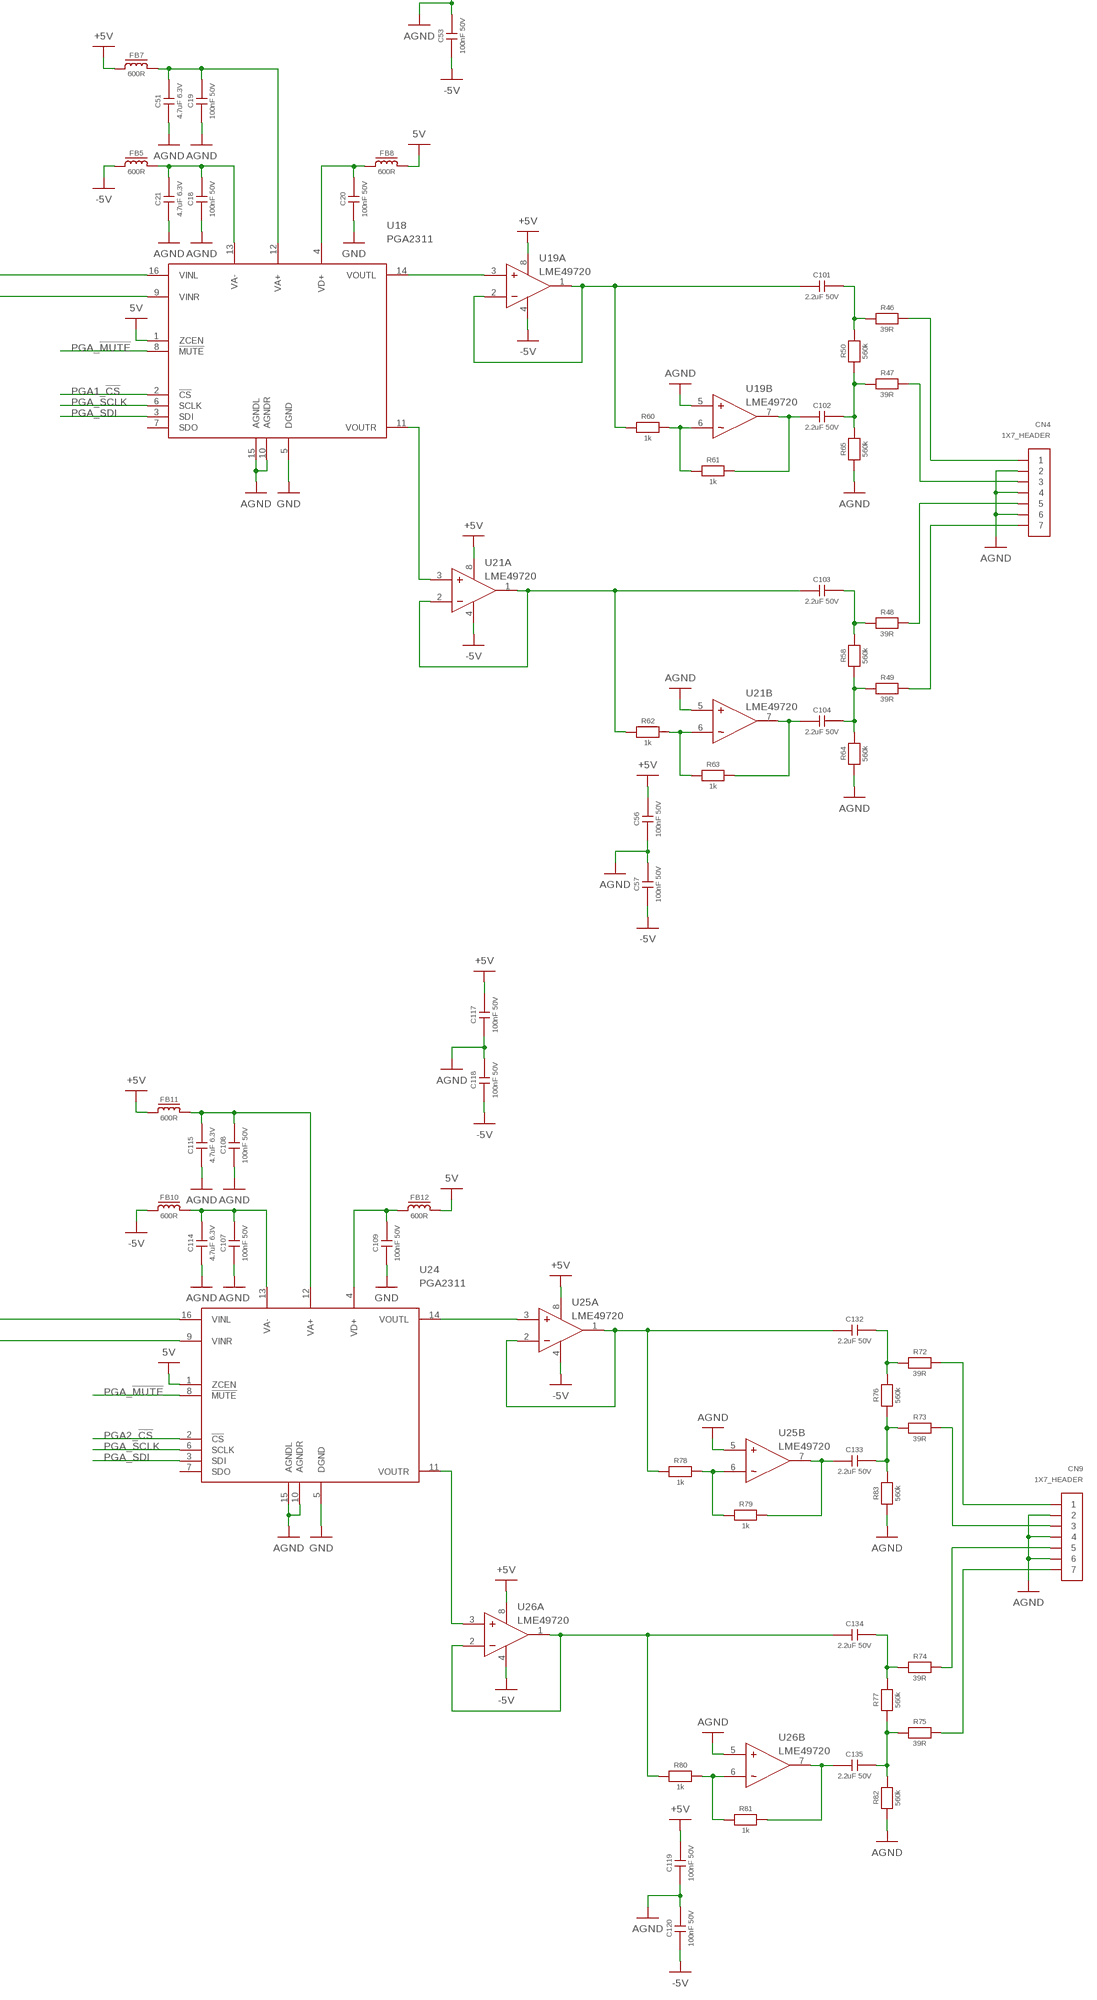
[diagram p7: schematic, sheet 3, part 4 of 4]

### Parts
C1  100nF 50V  VJ0603Y104KXACW1BC  [0603]
C9  100nF 50V  VJ0603Y104KXACW1BC  [0603]
C10  2.2uF 50V  MKS2B042201F00KSSD  [5X7.2BOX]
C11  2.2uF 50V  MKS2B042201F00KSSD  [5X7.2BOX]
C12  2.2uF 50V  MKS2B042201F00KSSD  [5X7.2BOX]
C13  2.2uF 50V  MKS2B042201F00KSSD  [5X7.2BOX]
C14  330nF 16V  ECPU1C334MA5  [1206]
C15  330nF 16V  ECPU1C334MA5  [1206]
C18  100nF 50V  VJ0603Y104KXACW1BC  [0603]
C19  100nF 50V  VJ0603Y104KXACW1BC  [0603]
C20  100nF 50V  VJ0603Y104KXACW1BC  [0603]
C21  4.7uF 6.3V  GRM188R60J475ME19D  [0603]
C27  100nF 50V  VJ0603Y104KXACW1BC  [0603]
C28  100pF 50V  C0603C101K5GACTU  [0603]
C29  10uF 16V  MC1206B106K160CT  [1206]
C30  100nF 50V  VJ0603Y104KXACW1BC  [0603]
C31  470pF 16V  ECHU1C471GX5  [0603]
C32  470pF 16V  ECHU1C471GX5  [0603]
C33  470pF 16V  ECHU1C471GX5  [0603]
C34  470pF 16V  ECHU1C471GX5  [0603]
C35  100nF 50V  VJ0603Y104KXACW1BC  [0603]
C39  100nF 50V  VJ0603Y104KXACW1BC  [0603]
C40  100nF 50V  VJ0603Y104KXACW1BC  [0603]
C41  4.7uF 6.3V  GRM188R60J475ME19D  [0603]
C42  4.7uF 6.3V  GRM188R60J475ME19D  [0603]
C43  100nF 50V  VJ0603Y104KXACW1BC  [0603]
C44  100nF 50V  VJ0603Y104KXACW1BC  [0603]
C45  100nF 50V  VJ0603Y104KXACW1BC  [0603]
C46  100nF 50V  VJ0603Y104KXACW1BC  [0603]
C51  4.7uF 6.3V  GRM188R60J475ME19D  [0603]
C52  100nF 50V  VJ0603Y104KXACW1BC  [0603]
C53  100nF 50V  VJ0603Y104KXACW1BC  [0603]
C55  10uF 16V  MC1206B106K160CT  [1206]
C56  100nF 50V  VJ0603Y104KXACW1BC  [0603]
C57  100nF 50V  VJ0603Y104KXACW1BC  [0603]
C58  100nF 50V  VJ0603Y104KXACW1BC  [0603]
C59  100pF 50V  C0603C101K5GACTU  [0603]
C60  10uF 16V  MC1206B106K160CT  [1206]
C61  100nF 50V  VJ0603Y104KXACW1BC  [0603]
C63  470pF 16V  ECHU1C471GX5  [0603]
C64  470pF 16V  ECHU1C471GX5  [0603]
C65  470pF 16V  ECHU1C471GX5  [0603]
C66  470pF 16V  ECHU1C471GX5  [0603]
C67  10uF 16V  MC1206B106K160CT  [1206]
C68  100nF 50V  VJ0603Y104KXACW1BC  [0603]
C75  100nF 50V  VJ0603Y104KXACW1BC  [0603]
C101  2.2uF 50V  MKS2B042201F00KSSD  [5X7.2BOX]
C102  2.2uF 50V  MKS2B042201F00KSSD  [5X7.2BOX]
C103  2.2uF 50V  MKS2B042201F00KSSD  [5X7.2BOX]
C104  2.2uF 50V  MKS2B042201F00KSSD  [5X7.2BOX]
C105  330nF 16V  ECPU1C334MA5  [1206]
C106  330nF 16V  ECPU1C334MA5  [1206]
C107  100nF 50V  VJ0603Y104KXACW1BC  [0603]
C108  100nF 50V  VJ0603Y104KXACW1BC  [0603]
C109  100nF 50V  VJ0603Y104KXACW1BC  [0603]
C114  4.7uF 6.3V  GRM188R60J475ME19D  [0603]
C115  4.7uF 6.3V  GRM188R60J475ME19D  [0603]
C117  100nF 50V  VJ0603Y104KXACW1BC  [0603]
C118  100nF 50V  VJ0603Y104KXACW1BC  [0603]
C119  100nF 50V  VJ0603Y104KXACW1BC  [0603]
C120  100nF 50V  VJ0603Y104KXACW1BC  [0603]
C121  100nF 50V  VJ0603Y104KXACW1BC  [0603]
C122  100pF 50V  C0603C101K5GACTU  [0603]
C123  10uF 16V  MC1206B106K160CT  [1206]
C124  100nF 50V  VJ0603Y104KXACW1BC  [0603]
C125  470pF 16V  ECHU1C471GX5  [0603]
C126  470pF 16V  ECHU1C471GX5  [0603]
C127  470pF 16V  ECHU1C471GX5  [0603]
C128  470pF 16V  ECHU1C471GX5  [0603]
C129  10uF 16V  MC1206B106K160CT  [1206]
C130  100nF 50V  VJ0603Y104KXACW1BC  [0603]
C131  100nF 50V  VJ0603Y104KXACW1BC  [0603]
C132  2.2uF 50V  MKS2B042201F00KSSD  [5X7.2BOX]
C133  2.2uF 50V  MKS2B042201F00KSSD  [5X7.2BOX]
C134  2.2uF 50V  MKS2B042201F00KSSD  [5X7.2BOX]
C135  2.2uF 50V  MKS2B042201F00KSSD  [5X7.2BOX]
C136  330nF 16V  ECPU1C334MA5  [1206]
C137  330nF 16V  ECPU1C334MA5  [1206]
CN1  1X7_HEADER  [7PIN_HEADER]
CN4  1X7_HEADER  [7PIN_HEADER]
CN9  1X7_HEADER  [7PIN_HEADER]
FB1  600R  742792651  [0603]
FB3  600R  742792651  [0603]
FB4  600R  742792651  [0603]
FB5  600R  742792651  [0603]
FB6  600R  742792651  [0603]
FB7  600R  742792651  [0603]
FB8  600R  742792651  [0603]
FB9  600R  742792651  [0603]
FB10  600R  742792651  [0603]
FB11  600R  742792651  [0603]
FB12  600R  742792651  [0603]
FB13  600R  742792651  [0603]
R3  1k  CRCW06031K00FKEA  [0603]
R4  1k  CRCW06031K00FKEA  [0603]
R5  1k  CRCW06031K00FKEA  [0603]
R6  1k  CRCW06031K00FKEA  [0603]
R7  39R  CRCW060339R0FKEA  [0603]
R8  560k  CRCW0603560KFKEA  [0603]
R9  39R  CRCW060339R0FKEA  [0603]
R10  39R  CRCW060339R0FKEA  [0603]
R11  560k  CRCW0603560KFKEA  [0603]
R12  20k0  CRCW060320K0FKEA  [0603]
R13  20k0  CRCW060320K0FKEA  [0603]
R14  20k0  CRCW060320K0FKEA  [0603]
R15  20k0  CRCW060320K0FKEA  [0603]
R16  560k  CRCW0603560KFKEA  [0603]
R17  560k  CRCW0603560KFKEA  [0603]
R18  180k  CRCW0603180KFKEA  [0603]
R19  180k  CRCW0603180KFKEA  [0603]
R21  39R  CRCW060339R0FKEA  [0603]
R31  20k0  CRCW060320K0FKEA  [0603]
R32  20k0  CRCW060320K0FKEA  [0603]
R33  20k0  CRCW060320K0FKEA  [0603]
R34  20k0  CRCW060320K0FKEA  [0603]
R35  180k  CRCW0603180KFKEA  [0603]
R36  180k  CRCW0603180KFKEA  [0603]
R46  39R  CRCW060339R0FKEA  [0603]
R47  39R  CRCW060339R0FKEA  [0603]
R48  39R  CRCW060339R0FKEA  [0603]
R49  39R  CRCW060339R0FKEA  [0603]
R50  560k  CRCW0603560KFKEA  [0603]
R58  560k  CRCW0603560KFKEA  [0603]
R60  1k  CRCW06031K00FKEA  [0603]
R61  1k  CRCW06031K00FKEA  [0603]
R62  1k  CRCW06031K00FKEA  [0603]
R63  1k  CRCW06031K00FKEA  [0603]
R64  560k  CRCW0603560KFKEA  [0603]
R65  560k  CRCW0603560KFKEA  [0603]
R66  20k0  CRCW060320K0FKEA  [0603]
R67  20k0  CRCW060320K0FKEA  [0603]
R68  20k0  CRCW060320K0FKEA  [0603]
R69  20k0  CRCW060320K0FKEA  [0603]
R70  180k  CRCW0603180KFKEA  [0603]
R71  180k  CRCW0603180KFKEA  [0603]
R72  39R  CRCW060339R0FKEA  [0603]
R73  39R  CRCW060339R0FKEA  [0603]
R74  39R  CRCW060339R0FKEA  [0603]
R75  39R  CRCW060339R0FKEA  [0603]
R76  560k  CRCW0603560KFKEA  [0603]
R77  560k  CRCW0603560KFKEA  [0603]
R78  1k  CRCW06031K00FKEA  [0603]
R79  1k  CRCW06031K00FKEA  [0603]
R80  1k  CRCW06031K00FKEA  [0603]
R81  1k  CRCW06031K00FKEA  [0603]
R82  560k  CRCW0603560KFKEA  [0603]
R83  560k  CRCW0603560KFKEA  [0603]
U2  PCM1754  [SSOP16-4MM@1]
U3  LME49720  LME49720MA/NOPB  [SO8]
U6  PGA2311  PGA2311UA  [SOL16]
U7  LME49720  LME49720MA/NOPB  [SO8]
U8  LME49720  LME49720MA/NOPB  [SO8]
U18  PGA2311  PGA2311UA  [SOL16]
U19  LME49720  LME49720MA/NOPB  [SO8]
U21  LME49720  LME49720MA/NOPB  [SO8]
U22  PCM1754  [SSOP16-4MM@1]
U23  LME49720  LME49720MA/NOPB  [SO8]
U24  PGA2311  PGA2311UA  [SOL16]
U25  LME49720  LME49720MA/NOPB  [SO8]
U26  LME49720  LME49720MA/NOPB  [SO8]
U27  PCM1754  [SSOP16-4MM@1]
U28  LME49720  LME49720MA/NOPB  [SO8]

### Nets
5V: FB4.2 FB8.2 FB12.2 U6.1(ZCEN) U18.1(ZCEN) U24.1(ZCEN) ; also sheet 4
+5V: C9.2 C43.2 C45.2 C52.2 C56.2 C68.2 C117.2 C119.2 C130.2 FB3.1 FB6.2 FB7.1 FB9.2 FB11.1 FB13.2 U3.8(A:V+) U7.8(A:V+) U8.8(A:V+) U19.8(A:V+) U21.8(A:V+) U23.8(A:V+) U25.8(A:V+) U26.8(A:V+) U28.8(A:V+) ; also sheet 4
-5V: C35.1 C44.1 C46.1 C53.1 C57.1 C75.1 C118.1 C120.1 C131.1 FB1.1 FB5.1 FB10.1 U3.4(A:V-) U7.4(A:V-) U8.4(A:V-) U19.4(A:V-) U21.4(A:V-) U23.4(A:V-) U25.4(A:V-) U26.4(A:V-) U28.4(A:V-) ; also sheet 4
AGND: C1.1 C9.1 C18.1 C19.1 C21.1 C27.1 C28.1 C29.1 C30.1 C32.2 C33.2 C35.2 C39.1 C41.1 C42.1 C43.1 C44.2 C45.1 C46.2 C51.1 C52.1 C53.2 C55.1 C56.1 C57.2 C58.1 C59.1 C60.1 C61.1 C63.2 C65.2 C67.1 C68.1 C75.2 C107.1 C108.1 C114.1 C115.1 C117.1 C118.2 C119.1 C120.2 C121.1 C122.1 C123.1 C124.1 C125.2 C127.2 C129.1 C130.1 C131.2 CN1.2 CN1.4 CN1.6 CN4.2 CN4.4 CN4.6 CN9.2 CN9.4 CN9.6 R16.1 R17.1 R18.1 R19.1 R35.1 R36.1 R64.1 R65.1 R70.1 R71.1 R82.1 R83.1 U2.9(AGND) U6.10(AGNDR) U6.15(AGNDL) U7.5(B:+) U8.5(B:+) U18.10(AGNDR) U18.15(AGNDL) U19.5(B:+) U21.5(B:+) U22.9(AGND) U24.10(AGNDR) U24.15(AGNDL) U25.5(B:+) U26.5(B:+) U27.9(AGND) ; also sheet 4
DAC0_I2S_BCLK: U2.1(BCK) ; also sheet 2
DAC0_I2S_DATA: U2.2(DATA) ; also sheet 2
DAC0_I2S_LRCLK: U2.3(LRCLK) ; also sheet 2
DAC0_I2S_SCLK: U2.16(SCK) ; also sheet 2
DAC1_I2S_BCLK: U22.1(BCK) ; also sheet 2
DAC1_I2S_DATA: U22.2(DATA) ; also sheet 2
DAC1_I2S_LRCLK: U22.3(LRCLK) ; also sheet 2
DAC1_I2S_SCLK: U22.16(SCK) ; also sheet 2
DAC2_I2S_BCLK: U27.1(BCK) ; also sheet 2
DAC2_I2S_DATA: U27.2(DATA) ; also sheet 2
DAC2_I2S_LRCLK: U27.3(LRCLK) ; also sheet 2
DAC2_I2S_SCLK: U27.16(SCK) ; also sheet 2
DAC_MUTE: U2.14(MUTE) U22.14(MUTE) U27.14(MUTE) ; also sheet 2
GND: C20.1 C40.1 C109.1 U2.4(DGND) U2.12(TEST) U2.13(DEMP) U2.15(FMT) U6.5(DGND) U18.5(DGND) U22.4(DGND) U22.12(TEST) U22.13(DEMP) U22.15(FMT) U24.5(DGND) U27.4(DGND) U27.12(TEST) U27.13(DEMP) U27.15(FMT) ; also sheet 1,2,4
N$1: R5.2 R6.1 U8.6(B:-)
N$2: C13.1 R6.2 U8.7(B:OUT)
N$6: C10.2 R7.1 R8.2
N$7: C11.2 R8.1 R9.1 R17.2
N$8: C12.2 R10.1 R11.2
N$9: C13.2 R11.1 R16.2 R21.1
N$10: CN1.1 R7.2
N$14: C27.2 C28.2 C55.2 FB6.1 U2.6(VCC)
N$15: C15.2 R14.1 R19.2
N$16: C14.2 R12.1 R18.2
N$18: C29.2 C30.2 U2.10(VCOM)
N$19: C31.2 R12.2 R13.1
N$20: C33.1 R13.2 U3.3(A:+)
N$21: C31.1 U3.1(A:OUT) U3.2(A:-) U6.16(VINL)
N$22: C34.2 R14.2 R15.1
N$23: C32.1 R15.2 U3.5(B:+)
N$24: C34.1 U3.6(B:-) U3.7(B:OUT) U6.9(VINR)
N$25: C15.1 U2.8(VOUT_R)
N$26: C14.1 U2.7(VOUT_L)
N$30: C1.2 C41.2 FB1.2 U6.13(VA-)
N$31: C39.2 C42.2 FB3.2 U6.12(VA+)
N$32: C40.2 FB4.1 U6.4(VD+)
N$33: C10.1 R3.1 U7.1(A:OUT) U7.2(A:-)
N$34: U6.14(VOUTL) U7.3(A:+)
N$35: R3.2 R4.1 U7.6(B:-)
N$36: CN1.7 R21.2
N$37: CN1.5 R10.2
N$38: C12.1 R5.1 U8.1(A:OUT) U8.2(A:-)
N$39: U6.11(VOUTR) U8.3(A:+)
N$41: C18.2 C21.2 FB5.2 U18.13(VA-)
N$42: CN1.3 R9.2
N$43: C11.1 R4.2 U7.7(B:OUT)
N$44: C19.2 C51.2 FB7.2 U18.12(VA+)
N$45: C20.2 FB8.1 U18.4(VD+)
N$49: C101.1 R60.1 U19.1(A:OUT) U19.2(A:-)
N$50: U18.14(VOUTL) U19.3(A:+)
N$51: R60.2 R61.1 U19.6(B:-)
N$58: C103.1 R62.1 U21.1(A:OUT) U21.2(A:-)
N$59: U18.11(VOUTR) U21.3(A:+)
N$60: R62.2 R63.1 U21.6(B:-)
N$61: C104.1 R63.2 U21.7(B:OUT)
N$62: C58.2 C59.2 C67.2 FB9.1 U22.6(VCC)
N$63: C60.2 C61.2 U22.10(VCOM)
N$64: C64.2 R31.2 R32.1
N$65: C63.1 R32.2 U23.3(A:+)
N$66: C64.1 U18.16(VINL) U23.1(A:OUT) U23.2(A:-)
N$67: C66.2 R33.2 R34.1
N$68: C65.1 R34.2 U23.5(B:+)
N$69: C66.1 U18.9(VINR) U23.6(B:-) U23.7(B:OUT)
N$71: C106.1 U22.8(VOUT_R)
N$72: C105.1 U22.7(VOUT_L)
N$73: C101.2 R46.1 R50.2
N$74: C102.2 R47.1 R50.1 R65.2
N$75: C103.2 R48.1 R58.2
N$76: C104.2 R49.1 R58.1 R64.2
N$77: CN4.1 R46.2
N$78: CN4.5 R48.2
N$79: C102.1 R61.2 U19.7(B:OUT)
N$80: CN4.7 R49.2
N$81: CN4.3 R47.2
N$82: C106.2 R33.1 R36.2
N$83: C105.2 R31.1 R35.2
N$84: C107.2 C114.2 FB10.2 U24.13(VA-)
N$86: C108.2 C115.2 FB11.2 U24.12(VA+)
N$87: C109.2 FB12.1 U24.4(VD+)
N$88: C132.1 R78.1 U25.1(A:OUT) U25.2(A:-)
N$89: U24.14(VOUTL) U25.3(A:+)
N$90: R78.2 R79.1 U25.6(B:-)
N$91: C134.1 R80.1 U26.1(A:OUT) U26.2(A:-)
N$92: U24.11(VOUTR) U26.3(A:+)
N$93: R80.2 R81.1 U26.6(B:-)
N$94: C135.1 R81.2 U26.7(B:OUT)
N$95: C121.2 C122.2 C129.2 FB13.1 U27.6(VCC)
N$96: C123.2 C124.2 U27.10(VCOM)
N$97: C126.2 R66.2 R67.1
N$98: C125.1 R67.2 U28.3(A:+)
N$99: C126.1 U24.16(VINL) U28.1(A:OUT) U28.2(A:-)
N$100: C128.2 R68.2 R69.1
N$101: C127.1 R69.2 U28.5(B:+)
N$102: C128.1 U24.9(VINR) U28.6(B:-) U28.7(B:OUT)
N$103: C137.1 U27.8(VOUT_R)
N$104: C136.1 U27.7(VOUT_L)
N$105: C132.2 R72.1 R76.2
N$106: C133.2 R73.1 R76.1 R83.2
N$107: C134.2 R74.1 R77.2
N$108: C135.2 R75.1 R77.1 R82.2
N$109: CN9.1 R72.2
N$110: CN9.5 R74.2
N$111: C133.1 R79.2 U25.7(B:OUT)
N$112: CN9.7 R75.2
N$113: CN9.3 R73.2
N$114: C137.2 R68.1 R71.2
N$115: C136.2 R66.1 R70.2
PGA0_!CS: U6.2(!CS) ; also sheet 2
PGA1_!CS: U18.2(!CS) ; also sheet 2
PGA2_!CS: U24.2(!CS) ; also sheet 2
PGA_!MUTE: U6.8(!MUTE) U18.8(!MUTE) U24.8(!MUTE) ; also sheet 2
PGA_SCLK: U6.6(SCLK) U18.6(SCLK) U24.6(SCLK) ; also sheet 2
PGA_SDI: U6.3(SDI) U18.3(SDI) U24.3(SDI) ; also sheet 2
Unconnected: U2.11(ZEROA) U6.7(SDO) U18.7(SDO) U22.11(ZEROA) U24.7(SDO) U27.11(ZEROA)

## Sheet 4 of 5: PSU
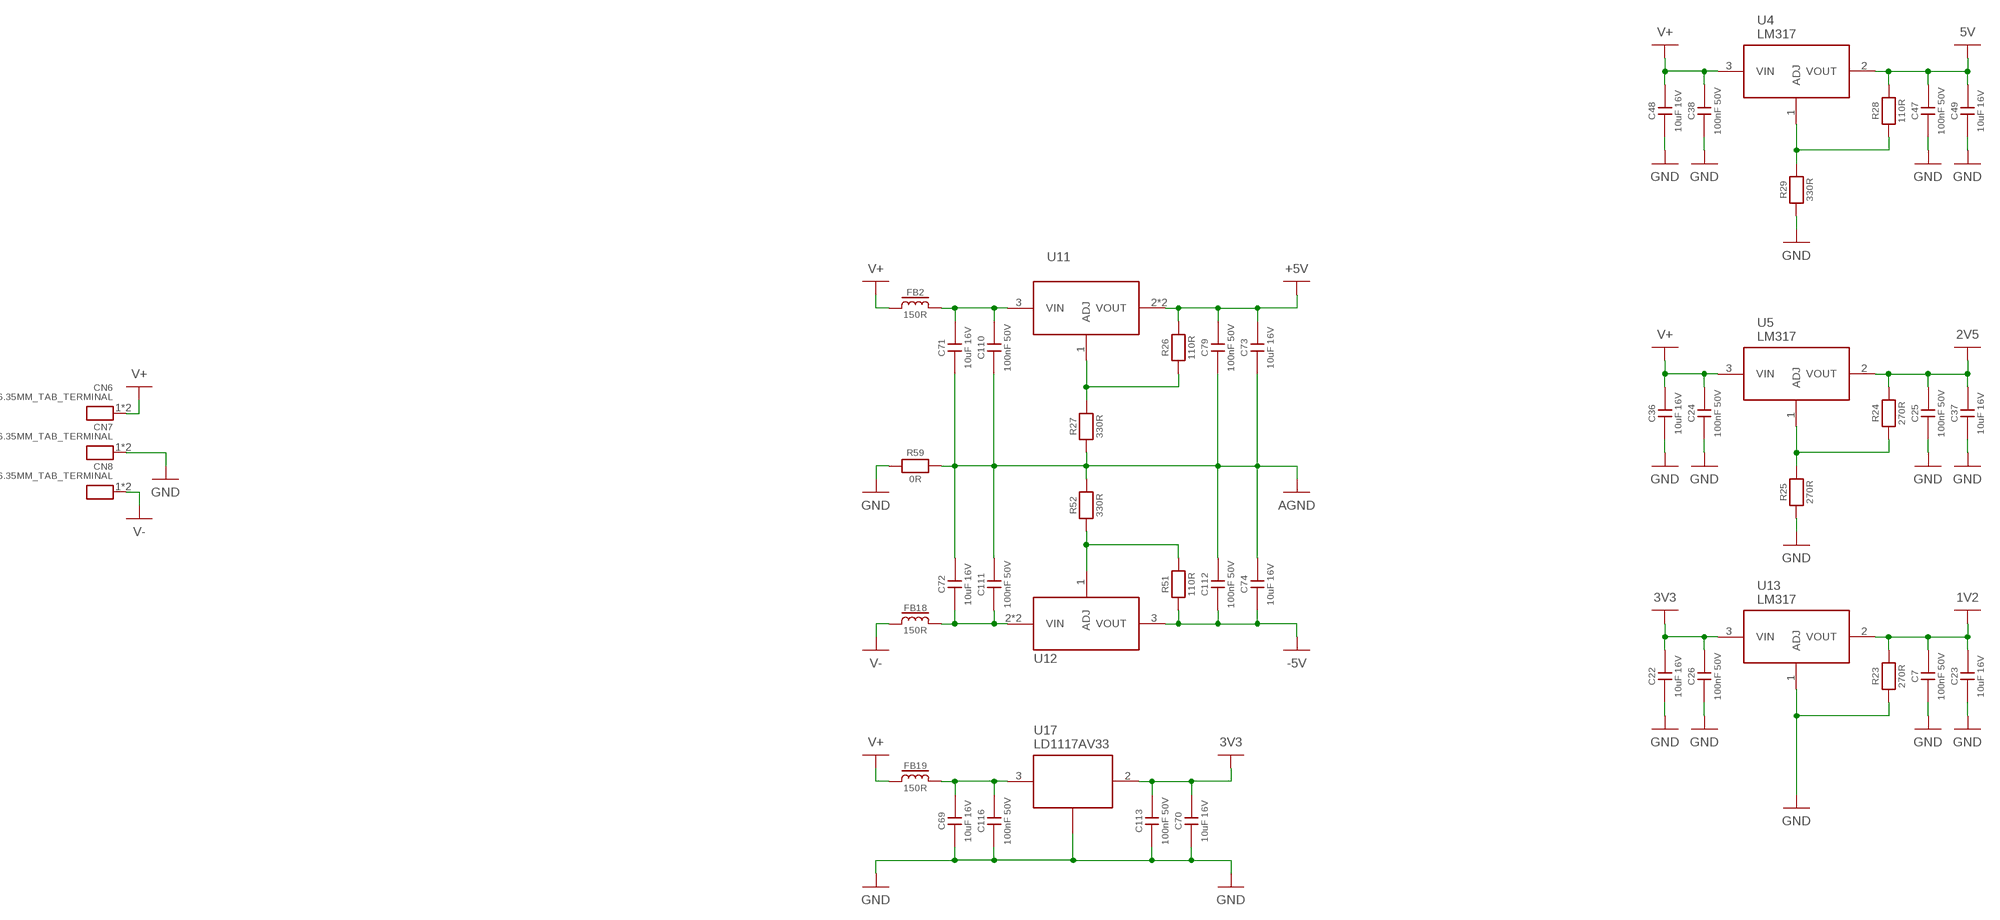
[diagram p8: schematic, sheet 4]

### Parts
C7  100nF 50V  VJ0603Y104KXACW1BC  [0603]
C22  10uF 16V  MC1206B106K160CT  [1206]
C23  10uF 16V  MC1206B106K160CT  [1206]
C24  100nF 50V  VJ0603Y104KXACW1BC  [0603]
C25  100nF 50V  VJ0603Y104KXACW1BC  [0603]
C26  100nF 50V  VJ0603Y104KXACW1BC  [0603]
C36  10uF 16V  MC1206B106K160CT  [1206]
C37  10uF 16V  MC1206B106K160CT  [1206]
C38  100nF 50V  VJ0603Y104KXACW1BC  [0603]
C47  100nF 50V  VJ0603Y104KXACW1BC  [0603]
C48  10uF 16V  MC1206B106K160CT  [1206]
C49  10uF 16V  MC1206B106K160CT  [1206]
C69  10uF 16V  MC1206B106K160CT  [1206]
C70  10uF 16V  MC1206B106K160CT  [1206]
C71  10uF 16V  MC1206B106K160CT  [1206]
C72  10uF 16V  MC1206B106K160CT  [1206]
C73  10uF 16V  MC1206B106K160CT  [1206]
C74  10uF 16V  MC1206B106K160CT  [1206]
C79  100nF 50V  VJ0603Y104KXACW1BC  [0603]
C110  100nF 50V  VJ0603Y104KXACW1BC  [0603]
C111  100nF 50V  VJ0603Y104KXACW1BC  [0603]
C112  100nF 50V  VJ0603Y104KXACW1BC  [0603]
C113  100nF 50V  VJ0603Y104KXACW1BC  [0603]
C116  100nF 50V  VJ0603Y104KXACW1BC  [0603]
CN6  6.35MM_TAB_TERMINAL  [6.35MM_TERMINAL]
CN7  6.35MM_TAB_TERMINAL  [6.35MM_TERMINAL]
CN8  6.35MM_TAB_TERMINAL  [6.35MM_TERMINAL]
FB2  150R  LI1206H151R-10  [1206]
FB18  150R  LI1206H151R-10  [1206]
FB19  150R  LI1206H151R-10  [1206]
R23  270R  CRCW0603270RFKEA  [0603]
R24  270R  CRCW0603270RFKEA  [0603]
R25  270R  CRCW0603270RFKEA  [0603]
R26  110R  CRCW0603110RFKEA  [0603]
R27  330R  CRCW0603330RFKEA  [0603]
R28  110R  CRCW0603110RFKEA  [0603]
R29  330R  CRCW0603330RFKEA  [0603]
R51  110R  CRCW0603110RFKEA  [0603]
R52  330R  CRCW0603330RFKEA  [0603]
R59  0R  CRCW06030000Z0EA  [0603]
U4  LM317  LM317LCPK  [SOT89]
U5  LM317  LM317LCPK  [SOT89]
U11  LM317MQDCYR  [SOT223]
U12  LM337IMP  [SOT223]
U13  LM317  LM317LCPK  [SOT89]
U17  LD1117AV33  [TO220]

### Nets
1V2: C7.2 C23.2 R23.2 U13.2(VOUT) ; also sheet 2
2V5: C25.2 C37.2 R24.2 U5.2(VOUT) ; also sheet 2
3V3: C22.2 C26.2 C70.2 C113.2 U13.3(VIN) U17.2(VOUT) ; also sheet 1,2
5V: C47.2 C49.2 R28.2 U4.2(VOUT) ; also sheet 3
+5V: C73.2 C79.2 R26.2 U11.2(VOUT) U11.4(VOUT) ; also sheet 3
-5V: C74.1 C112.1 R51.1 U12.3(VOUT) ; also sheet 3
AGND: C71.1 C72.2 C73.1 C74.2 C79.1 C110.1 C111.2 C112.2 R27.1 R52.2 R59.2 ; also sheet 3
GND: C7.1 C22.1 C23.1 C24.1 C25.1 C26.1 C36.1 C37.1 C38.1 C47.1 C48.1 C49.1 C69.1 C70.1 C113.1 C116.1 CN7.1 CN7.2 R23.1 R25.1 R29.1 R59.1 U13.1(ADJ) U17.1(GND) ; also sheet 1,2,3
N$3: R24.1 R25.2 U5.1(ADJ)
N$47: R26.1 R27.2 U11.1(ADJ)
N$48: C69.2 C116.2 FB19.2 U17.3(VIN)
N$52: R28.1 R29.2 U4.1(ADJ)
N$57: R51.2 R52.1 U12.1(ADJ)
N$70: C72.1 C111.1 FB18.2 U12.2(VIN) U12.4(VIN)
N$85: C71.2 C110.2 FB2.2 U11.3(VIN)
V+: C24.2 C36.2 C38.2 C48.2 CN6.1 CN6.2 FB2.1 FB19.1 U4.3(VIN) U5.3(VIN) ; also sheet 2
V-: CN8.1 CN8.2 FB18.1

## Sheet 5 of 5: MAINS
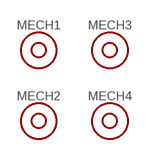
[diagram p9: schematic, sheet 5]

### Parts
MECH1  6mm x 3mm  MOUNTHOLE  [MOUNTHOLE_6X3]
MECH2  6mm x 3mm  MOUNTHOLE  [MOUNTHOLE_6X3]
MECH3  6mm x 3mm  MOUNTHOLE  [MOUNTHOLE_6X3]
MECH4  6mm x 3mm  MOUNTHOLE  [MOUNTHOLE_6X3]

## Library data of the parts
C1-C3 C6 C7 C9 C16 C18-C20 C24-C27 C30 C35 C38-C40 C43-C47 C50 C52 C53 C56-C58 C61 C62 C68 C75-C100 C107-C113 C116-C121 C124 C130 C131 C138-C140 = CAPACITORS:VJ0603Y104KXACW1BC: 100nF 50V X7R 10% 0603 MLCC.; FARNELL: 2407338; PRICE_PER: 0.0085
C4 C5 = CAPACITORS:MC0603N180J500CT: 18pF 50V C0G/NP0 5% 0603 MLCC.; FARNELL: 1759056; HEIGHT: 0.95; PRICE_PER: 0.0066
C8 = CAPACITORS:MC0603X105K250CT: 1uF 25V X5R 10% 0603 MLCC.; FARNELL: 1759409; HEIGHT: 0.95; PRICE_PER: 0.027
C10-C13 C101-C104 C132-C135 = CAPACITORS:MKS2B042201F00KSSD: 2.2UF 50V FILM 10% 7.2 x 5mm BOX; FARNELL: 107422; HEIGHT: 10; PRICE_PER: 1.28
C14 C15 C105 C106 C136 C137 = CAPACITORS:ECPU1C334MA5: 330nF 16V Film 20% 1206; FARNELL: 9694285; PRICE_PER: 0.47
C17 = CAPACITORS:GRM188R61E225KA12D: 2.2uF 25V X5R 10% 0603 MLCC.; FARNELL: 1845734; PRICE_PER: 0.0832
C21 C41 C42 C51 C114 C115 = CAPACITORS:GRM188R60J475ME19D: 4.7uF 6.3V X5R 10% 0603 MLCC.; FARNELL: 2362095; HEIGHT: 1; PRICE_PER: 0.0414
C22 C23 C29 C36 C37 C48 C49 C55 C60 C67 C69-C74 C123 C129 = CAPACITORS:MC1206B106K160CT: 10uF 16V X7R 10% 1206 MLCC.; FARNELL: 2320921; PRICE_PER: 0.101
C28 C59 C122 = CAPACITORS:C0603C101K5GACTU: 100pF 50V C0G/NP0 10% 0603 MLCC.; FARNELL: 2429360; HEIGHT: 1; PRICE_PER: 0.0116
C31-C34 C63-C66 C125-C128 = CAPACITORS:ECHU1C471GX5: 470pF 16V Film 2% 0603; FARNELL: 2326062; PRICE_PER: 0.275
C54 = CAPACITORS:MC0603B103K500CT: 10nF 50V X7R 10% 0603 MLCC.; FARNELL: 1759102; HEIGHT: 0.95; PRICE_PER: 0.0051
CN1 CN4 CN9 = CONNECTORs:1X7_HEADER: A 1 row, 7 column, 7 pin 0.1" header.
CN2 = CONNECTORs:SMAVERTICAL: 50ohm, through hole, RF jack.; FARNELL: 1248989
CN3 = CONNECTORs:5X2HEADER: 5x2 Header for the USB blaster for Altera FPGA programming.
CN5 CN10 = CONNECTORs:PICOBLADE_5_: 1.25mm pitch 1A connector. 5 way.; FARNELL: 9732861
CN6-CN8 = CONNECTORs:6.35MM_TAB_TERMINAL: 6.35mm wide, PCB mount spade terminal.
CN11 = CONNECTORs:2X3_HEADER: A 2 row, 3 column, 6 pin 0.1" header.
CN12 = CONNECTORs:PICOBLADE_3_: 1.25mm pitch 1A connector. 3 way.; FARNELL: 9732853
CN15 = CONNECTORs:MUSB-05-S-B-SM-A: 5 pin, SMD, mini USB connector.; FARNELL: 1753806
FB1 FB3-FB13 = INDUCTORS:742792651: Ferrite Bead 600R at 100MHz 0603.; FARNELL: 1635706
FB2 FB18 FB19 = INDUCTORS:LI1206H151R-10: Ferrite bead, 100MHz, 150R, 0.8A, 1206; FARNELL: 2292444
MECH1-MECH4 = MISC:MOUNTHOLE: Mechanical mounting hole.
R1 = RESISTORS:CRCW060375R0FKEA: 75 75R0 0603 0.1W 1% thick film resistor.; FARNELL: 1469838; HEIGHT: 0.5; PRICE_PER: 0.0096
R2 R27 R29 R52 = RESISTORS:CRCW0603330RFKEA: 330 330R 0603 0.1W 1% thick film resistor.; FARNELL: 1469803; HEIGHT: 0.5; PRICE_PER: 0.0095
R3-R6 R43-R45 R60-R63 R78-R81 = RESISTORS:CRCW06031K00FKEA: 1000 1k00 0603 0.1W 1% thick film resistor.; FARNELL: 2122366; HEIGHT: 0.5; PRICE_PER: 0.0031
R7 R9 R10 R21 R46-R49 R72-R75 = RESISTORS:CRCW060339R0FKEA: 39 39R0 0603 0.1W 1% thick film resistor.; FARNELL: 2141230; HEIGHT: 0.5; PRICE_PER: 0.0053
R8 R11 R16 R17 R50 R58 R64 R65 R76 R77 R82 R83 = RESISTORS:CRCW0603560KFKEA: 560000 560k 0603 0.1W 1% thick film resistor.; FARNELL: 2138575; HEIGHT: 0.5; PRICE_PER: 0.007
R12-R15 R31-R34 R66-R69 = RESISTORS:CRCW060320K0FKEA: 20000 20k0 0603 0.1W 1% thick film resistor; FARNELL: 1469774; HEIGHT: 0.5; PRICE_PER: 0.0108
R18 R19 R35 R36 R70 R71 = RESISTORS:CRCW0603180KFKEA: 180000 180k 0603 0.1W 1% thick film resistor.; FARNELL: 1652843; HEIGHT: 0.5; PRICE_PER: 0.0095
R20 R22 R30 R37-R39 R41 R42 R53-R57 R84 = RESISTORS:CRCW060310K0FKEA: 0603 10K0 0603 0.1W 1% thick film resistor.; FARNELL: 1469748; PRICE_PER: 0.0095
R23-R25 = RESISTORS:CRCW0603270RFKEA: 270 270R 0603 0.1W 1% thick film resistor.; FARNELL: 2141320; HEIGHT: 0.5; PRICE_PER: 0.0058
R26 R28 R51 = RESISTORS:CRCW0603110RFKEA: 110 110R 0603 0.1W 1% thick film resistor.; FARNELL: 2141282; HEIGHT: 0.5; PRICE_PER: 0.0076
R40 = RESISTORS:CRCW060316R0FKEA: 16 16R0 0603 0.1W 1% thick film resistor; FARNELL: 2141185; HEIGHT: 0.5; PRICE_PER: 0.0074
R59 = RESISTORS:CRCW06030000Z0EA: 0 0R 0603 0.1W thick film resistor; FARNELL: 1469739; HEIGHT: 0.5; PRICE_PER: 0.0194
TX1 = MISC:DA101C: Transformer, Digital Audio Data Transmission, 1:1, 1mH to 2.06mH, Through Hole, 6 Pin; FARNELL: 1362398; HEIGHT: 6.35; PRICE_PER: 1.2
U1 = ICs:WM8804: High performance SPDIF transceiver.; FARNELL: 1776282
U2 U22 U27 = ICs:PCM1754: x 24-Bit 192-kHz Sampling Enhanced Multi-Level Delta-Sigma Audio Digital-toAnalogue Converter; FARNELL: 2382835; PRICE_PER: 1.93
U3 U7 U8 U19 U21 U23 U25 U26 U28 = ICs:LME49720: LME49720 Dual High Performance, High Fidelity Audio Operational Amplifier. 0.00003% THD, +/-17V.; FARNELL: 1564794; PRICE_PER: 2.15
U4 U5 U13 = ICs:LM317: Linear Voltage Regulator, Adjustable, 38V primary input, 1.2V to 32V/100 mA/1 Output; FARNELL: 2323454; PRICE_PER: 0.631
U6 U18 U24 = ICs:PGA2311: Very high performance volume control solution. SPI controlled, mute, crossing detect. SOL16.; FARNELL: 1648764
U9 = ICs:EP4CE6E22C8N: 6K LE, 144pin EQFP, Cyclone IV FPGA; FARNELL: 2100851
U10 = ICs:M25P16-VMN6P: 16 Mbit, serial Flash memory, 75 MHz SPI bus interface. Cheap alternative to the Altera EPCS16 device.; FARNELL: 1734973
U11 = ICs:LM317: Linear Voltage Regulator, Adjustable, 38V primary input, 1.2V to 32V/100 mA/1 Output; FARNELL: 2075437
U12 = ICs:LM337: Adjustable negative voltage regulator.; FARNELL: 9779213
U14 = ICs:ASEMB-24.576MHZ: OSC MEMS 24.576MHZ CMOS SMD; DIGIKEY: 535-11092-1-ND; PRICE_PER: 1.40
U15 = ICs:USBLC6-2SC6: Very low capacitance ESD protection; FARNELL: 1269406; PRICE_PER: 0.2288
U16 = ICs:FT230X: FTDI FT230XS USB Interface, Transceiver, USB 2.0, 2.97 V, 5.5 V, SSOP, 16; FARNELL: 2081321; PRICE_PER: 1.29
U17 = ICs:LD1117AV33: Fixed LDO Voltage Regulator, 5.3V to 10V, 1.15V Dropout, 3.3Vout, 1Aout, TO-220-3; FARNELL: 1087165; PRICE_PER: 0.732
U20 = CRYSTALS:510BBA100M000BAG: OSC, 100MHZ, ±50PPM, 3.3V, SMD; FARNELL: 2393908; PRICE_PER: 2.88
U29 = ICs:STM32F030F4: 32 Bit Microcontroller, Value Line, ARM Cortex-M0, 48 MHz, 16 KB, 4 KB, 20 Pins, TSSOP; FARNELL: 2432084; PRICE_PER: 1.12
U30 = ICs:SST26VF016B: Flash Memory, 16 Mbit, 2M x 8bit, 104 MHz, SPI, SQI, SOIC, 8 Pins; FARNELL: 2774949; PRICE_PER: 1.16
XTAL1 = CRYSTALS:ABM8-12.000MHZ-B2-T: Small SMD Crystal, 12MHz.; FARNELL: 2467828